# Altium project Water_Prj.PrjPCB
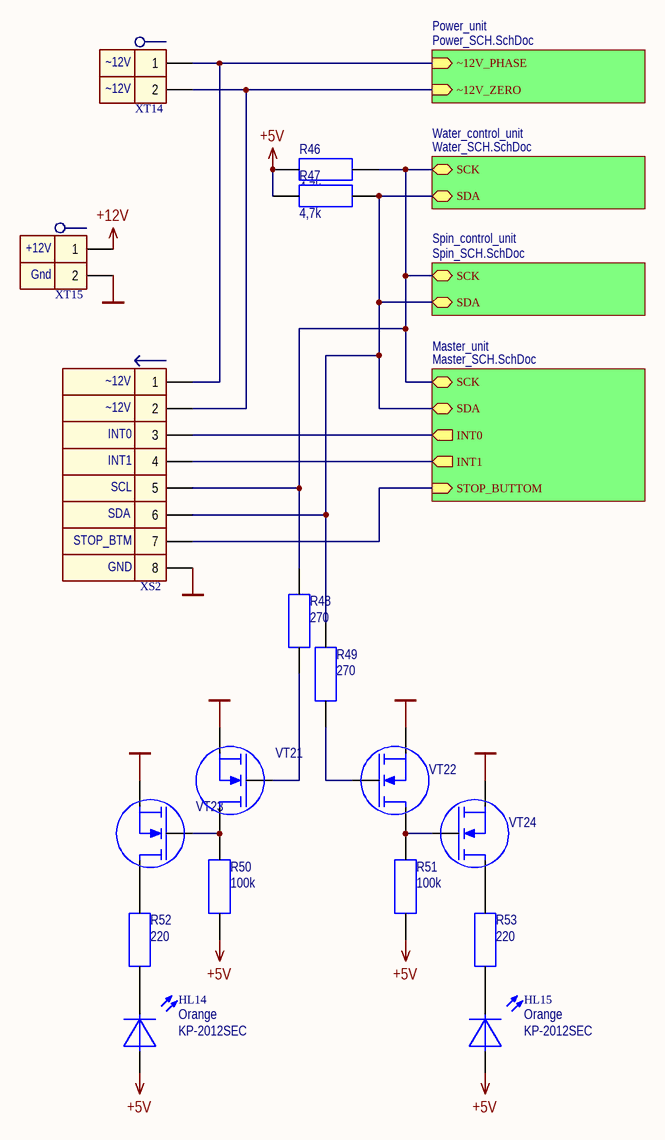
[diagram p0: TopSCH.SchDoc]
6 sheets, 230 parts. Net scope: hierarchical (ports join the sheet entries above them; power ports are global).
Board file: Control_PCB.PcbDoc
Sheets:
  TopSCH.SchDoc
    Water_control_unit = Water_SCH.SchDoc
      U_heatersControl = heatersControl.SchDoc
    Spin_control_unit = Spin_SCH.SchDoc
    Master_unit = Master_SCH.SchDoc
    Power_unit = Power_SCH.SchDoc

## Sheet TopSCH.SchDoc: Схема соединения
size 420 x 297 mm; ApprovedBy: Мешков; CheckedBy: Черноскутов; Author: Самойлов; CompanyName: РГППУ; Title2str: основных блоков; DecimalNumber: АБВГ.123456.001 33

### Parts
HL14  Orange  ManufacturerPartNumber: KP-2012SEC  [DIOMELF2012M]
HL15  Orange  ManufacturerPartNumber: KP-2012SEC  [DIOMELF2012M]
R46  4,7k  [SMDRC0805]
R47  4,7k  [SMDRC0805]
R48  270  [SMDRC0805]
R49  270  [SMDRC0805]
R50  100k  [SMDRC0805]
R51  100k  [SMDRC0805]
R52  220  [SMDRC0805]
R53  220  [SMDRC0805]
VT21  2N7002  [SOT23 (TO-236AB)]  (value not drawn)
VT22  2N7002  [SOT23 (TO-236AB)]  (value not drawn)
VT23  2N7002  [SOT23 (TO-236AB)]  (value not drawn)
VT24  2N7002  [SOT23 (TO-236AB)]  (value not drawn)
XS2  PLS-08R  [PLS-08R1]  (value not drawn)
XT14  330-021-12  [330-021-12]  (value not drawn)
XT15  330-021-12  [330-021-12]  (value not drawn)

### Sub-sheets
Master_unit = Master_SCH.SchDoc: SCK (bidir), SDA (bidir), STOP_BUTTOM (in), INT0 (out), INT1 (out)
Power_unit = Power_SCH.SchDoc: ~12V_PHASE (in), ~12V_ZERO (in)
Spin_control_unit = Spin_SCH.SchDoc: SCK (bidir), SDA (bidir)
Water_control_unit = Water_SCH.SchDoc: SCK (bidir), SDA (bidir)

### Nets
+5V: HL14.1 HL15.1 R46.2 R47.2 R50.2 R51.2
+12V: XT15.1
GND: VT21.2(S) VT22.2(S) VT23.2(S) VT24.2(S) XS2.8 XT15.2
~12V_PHASE: XS2.1 XT14.1 ; sheet Power_unit/~12V_PHASE
~12V_ZERO: XS2.2 XT14.2 ; sheet Power_unit/~12V_ZERO
NetDD1_19: R46.1 R48.2 XS2.5 ; sheet Water_control_unit/SCK, sheet Spin_control_unit/SCK, sheet Master_unit/SCK
NetDD1_20: R47.1 R49.2 XS2.6 ; sheet Water_control_unit/SDA, sheet Spin_control_unit/SDA, sheet Master_unit/SDA
NetDD3_12: XS2.7 ; sheet Master_unit/STOP_BUTTOM
NetDD3_13: XS2.3 ; sheet Master_unit/INT0
NetDD3_14: XS2.4 ; sheet Master_unit/INT1
NetHL14_2: HL14.2 R52.2
NetHL15_2: HL15.2 R53.2
NetR48_1: R48.1 VT21.1(G)
NetR49_1: R49.1 VT22.1(G)
NetR50_1: R50.1 VT21.3(D) VT23.1(G)
NetR51_1: R51.1 VT22.3(D) VT24.1(G)
NetR52_1: R52.1 VT23.3(D)
NetR53_1: R53.1 VT24.3(D)

### Notes on the sheet
- (near XT14) ~12V
- (near XT15) +12V
- (near XT15) Gnd
- (near XS2) ~12V
- (near XS2) INT0
- (near XS2) INT1
- (near XS2) SDA
- (near XS2) SCL
- (near XS2) STOP_BTM
- (near XS2) GND
- Изм.
- Лист
- N*докум.
- Подп.
- Дата
- Лит.
- Масса
- Масштаб
- Разраб.
- Пров.
- Т.контр.
- Лиcт
- Лиcтов
- Н.контр.
- Утв.

### Library data of the parts
HL14 HL15 = LED1_O: Diod LED SMD Orange; ComponentLink1Description: Datasheet; Cost: 4,91; ComponentLink2Description: Datasheet-local; ComponentLink2URL: *; Color: Orange
R46 R47 = Resistor 0805 4,7k: Generic resistor; PartNumber: Resistor 0805 4,7k; Value: 4,7k; ComponentLink1URL: http://www.mouser.com/ds/2/447/PYu-RC0402_51_RoHS_L_6_r-8721.pdf; ComponentLink1Description: Datasheet; Package: 0805
R48 R49 = Resistor 0805 270: Generic resistor; PartNumber: Resistor 0805 270; Value: 270; ComponentLink1URL: http://www.mouser.com/ds/2/447/PYu-RC0402_51_RoHS_L_6_r-8721.pdf; ComponentLink1Description: Datasheet; Package: 0805
R50 R51 = Resistor 0805 100k: Generic resistor; PartNumber: Resistor 0805 100k; Value: 100k; ComponentLink1URL: http://www.mouser.com/ds/2/447/PYu-RC0402_51_RoHS_L_6_r-8721.pdf; ComponentLink1Description: Datasheet; Package: 0805
R52 R53 = Resistor 0805 220: Generic resistor; PartNumber: Resistor 0805 220; Value: 220; ComponentLink1URL: http://www.mouser.com/ds/2/447/PYu-RC0402_51_RoHS_L_6_r-8721.pdf; ComponentLink1Description: Datasheet; Package: 0805
VT21-VT24 = 2N7002 n-MOSFET: 60V, 300mA N-channel Trench MOSFET; ManufacturerPartNumber: 2N7002
XS2 = Con8_M PLS-08MR: Male 8-pin connection; ManufacturerPartNumber: PLS-08R; ComponentLink1Description: Datasheet; ComponentLink1URL: http://www.promelec.ru/catalog/406/1218/1223/1/99528/; ComponentLink2Description: Datasheet-local; ComponentLink2URL: *
XT14 XT15 = Con2_D 330-021-12: Demountable connection  2-pin; Manufacturer: Degson Electronics Co., Ltd; ManufacturerPartNumber: 330-021-12; ComponentLink1Description: Datasheet; Cost: 7,45; Supplier: Промэлектроника; ComponentLink2Description: Datasheet-local

## Sheet Water_SCH.SchDoc: Блок управления
size 420 x 297 mm; ApprovedBy: Мешков; CheckedBy: Черноскутов; Author: Самойлов; CompanyName: РГППУ; Title2str: водой; DecimalNumber: АБВГ.123456.001 33
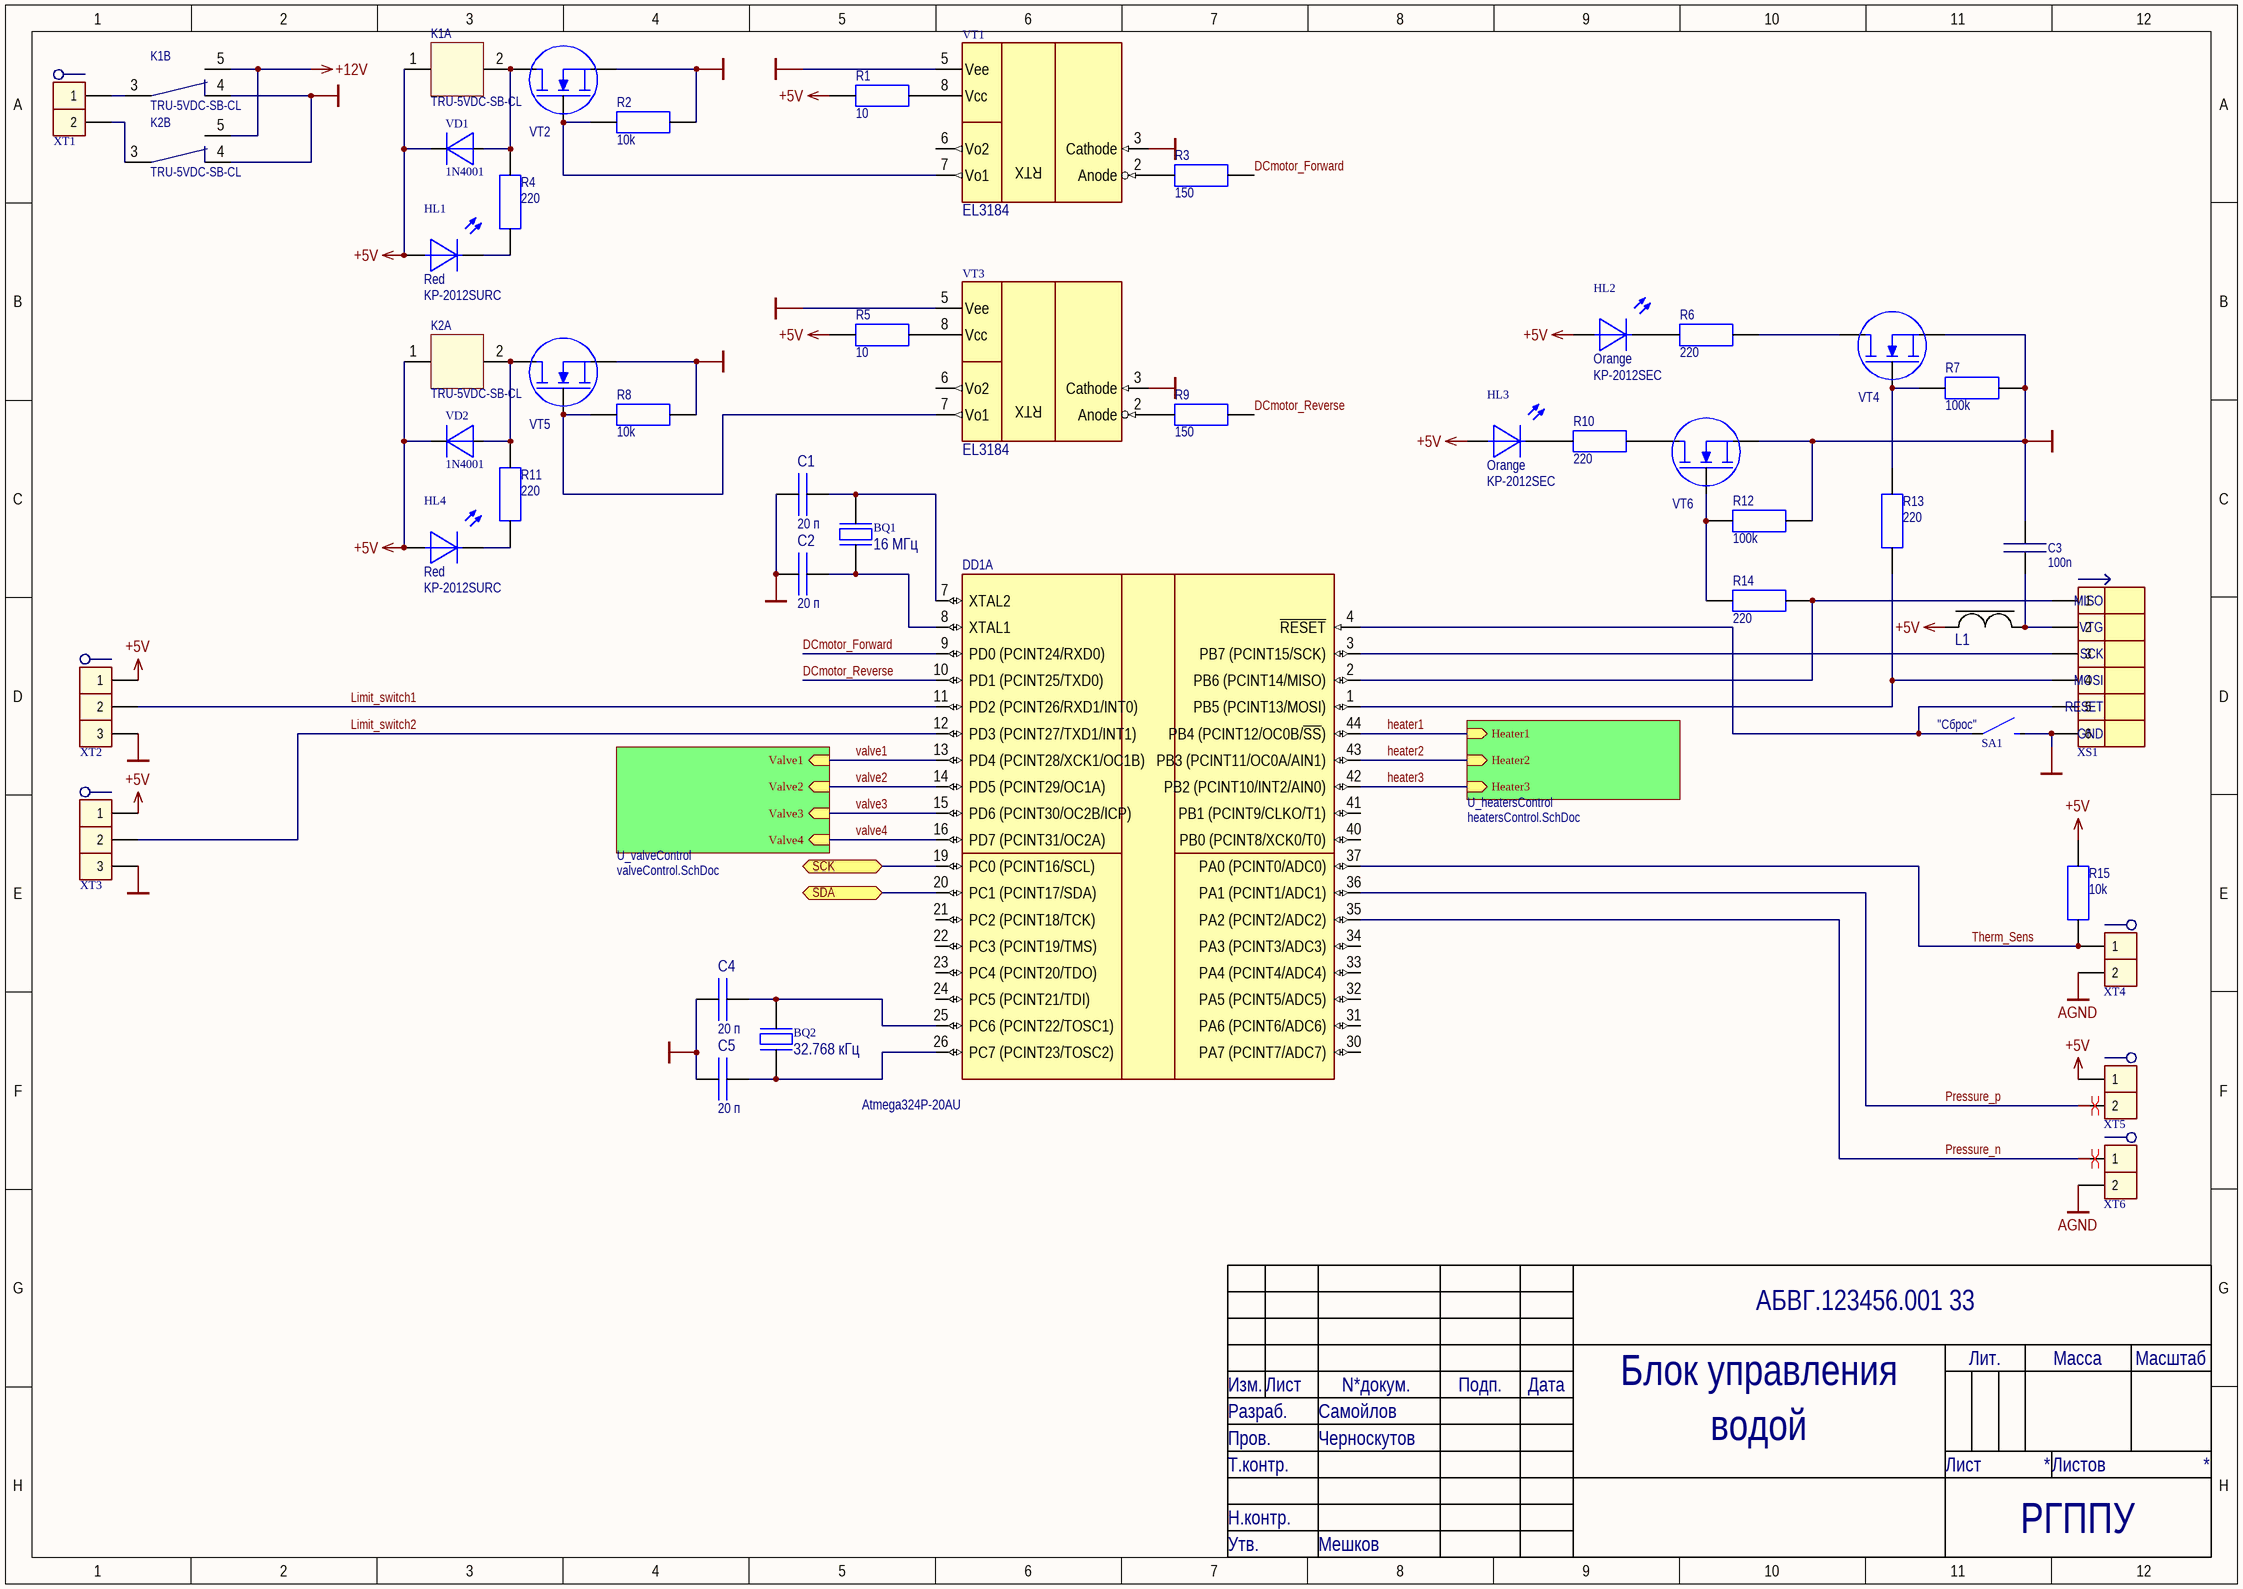
[diagram p1: Water_SCH.SchDoc]

### Parts
BQ1  16 МГц  [HC-49/S]
BQ2  32.768 кГц  [HC-49/S]
C1  value 20 п  [CAPC3216X05M]  (hidden comment: CC0603JRNP09BN200)
C2  value 20 п  [CAPC3216X05M]  (hidden comment: CC0603JRNP09BN200)
C3  100n  [SMDRC0805]
C4  value 20 п  [CAPC3216X05M]  (hidden comment: CC0603JRNP09BN200)
C5  value 20 п  [CAPC3216X05M]  (hidden comment: CC0603JRNP09BN200)
DD1  Atmega324P-20AU  [44ML_M]  (part A of 2)
HL1  Red  ManufacturerPartNumber: KP-2012SURC  [DIOMELF2012M]
HL2  Orange  ManufacturerPartNumber: KP-2012SEC  [DIOMELF2012M]
HL3  Orange  ManufacturerPartNumber: KP-2012SEC  [DIOMELF2012M]
HL4  Red  ManufacturerPartNumber: KP-2012SURC  [DIOMELF2012M]
K1  TRU-5VDC-SB-CL  [TRU-5VDC-SB-CL]  (parts A,B of 2)
K2  TRU-5VDC-SB-CL  [TRU-5VDC-SB-CL]  (parts A,B of 2)
L1  MPZ1608S181A  [INDC0603X03M]  (value not drawn)
R1  10  [SMDRC0805]
R2  10k  [SMDRC0805]
R3  150  [SMDRC0805]
R4  220  [SMDRC0805]
R5  10  [SMDRC0805]
R6  220  [SMDRC0805]
R7  100k  [SMDRC0805]
R8  10k  [SMDRC0805]
R9  150  [SMDRC0805]
R10  220  [SMDRC0805]
R11  220  [SMDRC0805]
R12  100k  [SMDRC0805]
R13  220  [SMDRC0805]
R14  220  [SMDRC0805]
R15  10k  [SMDRC0805]
SA1  DTSM20-4.3  [DTSM20]  (value not drawn)
VD1  1N4001  [PinDiode]
VD2  1N4001  [PinDiode]
VT1  EL3184  [DIP8]
VT2  2N7002  [SOT23 (TO-236AB)]  (value not drawn)
VT3  EL3184  [DIP8]
VT4  2N7002  [SOT23 (TO-236AB)]  (value not drawn)
VT5  2N7002  [SOT23 (TO-236AB)]  (value not drawn)
VT6  2N7002  [SOT23 (TO-236AB)]  (value not drawn)
XS1  IDC-06M  [IDC-06M]  (value not drawn)
XT1  330-021-12  [330-021-12]  (value not drawn)
XT2  330-031-12  [330-031-12]  (value not drawn)
XT3  330-031-12  [330-031-12]  (value not drawn)
XT4  330-021-12  [330-021-12]  (value not drawn)
XT5  330-021-12  [330-021-12]  (value not drawn)
XT6  330-021-12  [330-021-12]  (value not drawn)

### Sub-sheets
U_heatersControl = heatersControl.SchDoc: Heater1 (in), Heater2 (in), Heater3 (in)
U_valveСontrol = valveСontrol.SchDoc (file not in this document): Valve1 (in), Valve2 (in), Valve3 (in), Valve4 (in)

### Ports
SCK (bidir), SDA (bidir)

### Nets
+5V: HL1.1 HL2.1 HL3.1 HL4.1 K1.1 K2.1 L1.1 R1.2 R5.2 R15.2 VD1.K VD2.K XT2.1 XT3.1 XT5.1
+12V: K1.5 K2.5
AGND: XT4.2 XT6.2
GND: C1.2 C2.2 C3.2 C4.2 C5.2 K1.4 K2.4 R2.2 R7.2 R8.2 R12.2 SA1.2 VT1.3(Cathode) VT1.5(Vee) VT2.2(S) VT3.3(Cathode) VT3.5(Vee) VT4.2(S) VT5.2(S) VT6.2(S) XS1.6 XT2.3 XT3.3
DCmotor_Forward: DD1.9(PD0_(PCINT24/RXD0)) R3.1
DCmotor_Reverse: DD1.10(PD1_(PCINT25/TXD0)) R9.1
heater1: DD1.44(PB4_(PCINT12/OC0B/~{SS})) ; sheet U_heatersControl/Heater1
heater2: DD1.43(PB3_(PCINT11/OC0A/AIN1)) ; sheet U_heatersControl/Heater2
heater3: DD1.42(PB2_(PCINT10/INT2/AIN0)) ; sheet U_heatersControl/Heater3
Limit_switch1: DD1.11(PD2_(PCINT26/RXD1/INT0)) XT2.2
Limit_switch2: DD1.12(PD3_(PCINT27/TXD1/INT1)) XT3.2
Pressure_n: DD1.35(PA2_(PCINT2/ADC2)) XT6.1
Pressure_p: DD1.36(PA1_(PCINT1/ADC1)) XT5.2
Therm_Sens: DD1.37(PA0_(PCINT0/ADC0)) R15.1 XT4.1
valve1: DD1.13(PD4_(PCINT28/XCK1/OC1B)) ; sheet U_valveСontrol/Valve1
valve2: DD1.14(PD5_(PCINT29/OC1A)) ; sheet U_valveСontrol/Valve2
valve3: DD1.15(PD6_(PCINT30/OC2B/ICP)) ; sheet U_valveСontrol/Valve3
valve4: DD1.16(PD7_(PCINT31/OC2A)) ; sheet U_valveСontrol/Valve4
NetBQ1_1: BQ1.1 C2.1 DD1.8(XTAL1)
NetBQ1_2: BQ1.2 C1.1 DD1.7(XTAL2)
NetBQ2_1: BQ2.1 C5.1 DD1.26(PC7_(PCINT23/TOSC2))
NetBQ2_2: BQ2.2 C4.1 DD1.25(PC6_(PCINT22/TOSC1))
NetC3_1: C3.1 L1.2 XS1.2
NetDD1_1: DD1.1(PB5_(PCINT13/MOSI)) R13.1 XS1.4
NetDD1_2: DD1.2(PB6_(PCINT14/MISO)) R14.1 XS1.1
NetDD1_3: DD1.3(PB7_(PCINT15/SCK)) XS1.3
NetDD1_4: DD1.4(~{RESET}) SA1.1 XS1.5
NetDD1_19: DD1.19(PC0_(PCINT16/SCL)) ; port SCK
NetDD1_20: DD1.20(PC1_(PCINT17/SDA)) ; port SDA
NetHL1_2: HL1.2 R4.2
NetHL2_2: HL2.2 R6.2
NetHL3_2: HL3.2 R10.2
NetHL4_2: HL4.2 R11.2
NetK1_2: K1.2 R4.1 VD1.A VT2.3(D)
NetK1_3: K1.3 XT1.1
NetK2_2: K2.2 R11.1 VD2.A VT5.3(D)
NetK2_3: K2.3 XT1.2
NetR1_1: R1.1 VT1.8(Vcc)
NetR2_1: R2.1 VT1.7(Vo1) VT2.1(G)
NetR3_2: R3.2 VT1.2(Anode)
NetR5_1: R5.1 VT3.8(Vcc)
NetR6_1: R6.1 VT4.3(D)
NetR7_1: R7.1 R13.2 VT4.1(G)
NetR8_1: R8.1 VT3.7(Vo1) VT5.1(G)
NetR9_2: R9.2 VT3.2(Anode)
NetR10_1: R10.1 VT6.3(D)
NetR12_1: R12.1 R14.2 VT6.1(G)

Not connected (* = marked no-connect by the designer): DD1 21(PC2_(PCINT18/TCK)) 22(PC3_(PCINT19/TMS)) 23(PC4_(PCINT20/TDO)) 24(PC5_(PCINT21/TDI)) 30(PA7_(PCINT7/ADC7)) 31(PA6_(PCINT6/ADC6)) 32(PA5_(PCINT5/ADC5)) 33(PA4_(PCINT4/ADC4)) 34(PA3_(PCINT3/ADC3)) 40(PB0_(PCINT8/XCK0/T0)) 41(PB1_(PCINT9/CLKO/T1)); VT1 6(Vo2); VT3 6(Vo2)

### Layout directives
differential pair: Pressure_n, Pressure_p

### Notes on the sheet
- (near SA1) "Сброс"
- Изм.
- Лист
- N*докум.
- Подп.
- Дата
- Лит.
- Масса
- Масштаб
- Разраб.
- Пров.
- Т.контр.
- Лиcт
- Лиcтов
- Н.контр.
- Утв.
- (in symbol Con6_M IDC-06M_SPI) MISO; VTG; SCK; MOSI; RESET; GND
- (in symbol EL3184) RTX

### Library data of the parts
BQ1 BQ2 = Piezoelectric_16000: Piezoelectric elements; Manufacturer: Taizhou; ManufacturerPartNumber: 16000 кГц 20ppm 20pF; ComponentLink1URL: http://www.promelec.ru/catalog_info/54/126/246/70/; ComponentLink1Description: Datasheet; Package: HC-49/S; Cost: 8,54; Supplier: Промэлектроника; ComponentLink2Description: Datasheet-local
  BQ1: Value: 16 МГц
  BQ2: Value: 32.768 кГц
C1 C2 C4 C5 = p00020_050: 20pF Bipolar cap; Manufacturer: Yageo; ManufacturerPartNumber: CC0603JRNP09BN200; Supplier: Промэлектроника; Cost: 0,34; Package: 0603; ComponentLink1Description: Datasheet; ComponentLink1URL: http://www.yageo.com/documents/recent/UPY-GPHC_X5R_4V-to-50V_v16.pdf; ComponentLink2Description: Datasheet-local; ComponentLink2URL: *
C3 = Capacitor 0805 100n: Generic capasitor non-polar; PartNumber: Capacitor 0805 100n; Value: 100n; ComponentLink1Description: Datasheet; Package: 0805
DD1 = Atmega324P-20AU: Microcontroller 8-bit; Manufacturer: Atmel; ComponentLink1URL: http://www.atmel.com/Images/Atmel-8011-8-bit-AVR-Microcontroller-ATmega164P-324P-644P_datasheet.pdf; ComponentLink1Description: Datasheet; Cost: 220; Package: TQFP-44; Supplier: Промэлектроника; ManufacturerPartNumber: Atmega324P-20AU
HL1 HL4 = LED1_R: Diod LED SMD Red; ComponentLink1Description: Datasheet; Cost: 5,01; ComponentLink2Description: Datasheet-local; ComponentLink2URL: *; Color: Red
HL2 HL3 = LED1_O: Diod LED SMD Orange; ComponentLink1Description: Datasheet; Cost: 4,91; ComponentLink2Description: Datasheet-local; ComponentLink2URL: *; Color: Orange
L1 = Ferrite Bead: Value: ? мГн; ManufacturerPartNumber: MPZ1608S181A; ComponentLink1Description: Datasheet; Supplier: Промэлектроника; ComponentLink2Description: Datasheet-local; ComponentLink2URL: *
R1 R5 = Resistor 0805 10: Generic resistor; PartNumber: Resistor 0805 10; Value: 10; ComponentLink1URL: http://www.mouser.com/ds/2/447/PYu-RC0402_51_RoHS_L_6_r-8721.pdf; ComponentLink1Description: Datasheet; Package: 0805
R2 R8 R15 = Resistor 0805 10k: Generic resistor; PartNumber: Resistor 0805 10k; Value: 10k; ComponentLink1URL: http://www.mouser.com/ds/2/447/PYu-RC0402_51_RoHS_L_6_r-8721.pdf; ComponentLink1Description: Datasheet; Package: 0805
R3 R9 = Resistor 0805 150: Generic resistor; PartNumber: Resistor 0805 150; Value: 150; ComponentLink1URL: http://www.mouser.com/ds/2/447/PYu-RC0402_51_RoHS_L_6_r-8721.pdf; ComponentLink1Description: Datasheet; Package: 0805
R4 R6 R10 R11 R13 R14 = Resistor 0805 220: Generic resistor; PartNumber: Resistor 0805 220; Value: 220; ComponentLink1URL: http://www.mouser.com/ds/2/447/PYu-RC0402_51_RoHS_L_6_r-8721.pdf; ComponentLink1Description: Datasheet; Package: 0805
R7 R12 = Resistor 0805 100k: Generic resistor; PartNumber: Resistor 0805 100k; Value: 100k; ComponentLink1URL: http://www.mouser.com/ds/2/447/PYu-RC0402_51_RoHS_L_6_r-8721.pdf; ComponentLink1Description: Datasheet; Package: 0805
SA1 = Switch1_DTSM20-4.3: Switch open; Manufacturer: Diptronics; ManufacturerPartNumber: DTSM20-4.3; ComponentLink1Description: Datasheet; ComponentLink1URL: http://www.promelec.ru/catalog/407/1291/1323/1/70721/; ComponentLink2Description: Datasheet-local; ComponentLink2URL: *
VD1 VD2 = 1N4001: Rectifying diode; ComponentLink1Description: Datasheet; ComponentLink1URL: http://www.promelec.ru/pdf/1N400x.pdf; Cost: 5; Package: штырьевой; ComponentLink2Description: Datasheet-local; ComponentLink2URL: *; ManufacturerPartNumber: 1N4001
VT1 VT3 = EL3184: Optocouple IGBT driver; Manufacturer: Everlight Electronics Co. Ltd; Package: DIP-8; ComponentLink1URL: http://www.promelec.ru/pdf/EL3184-EVLT.pdf; ComponentLink1Description: Datasheet; Cost: 66,38; Supplier: Промэлектроника; ManufacturerPartNumber: EL3184
VT2 VT4-VT6 = 2N7002 n-MOSFET: 60V, 300mA N-channel Trench MOSFET; ManufacturerPartNumber: 2N7002
XS1 = Con6_M IDC-06M_SPI: SPI connector; ManufacturerPartNumber: IDC-06M; ComponentLink1Description: Datasheet; ComponentLink1URL: http://www.promelec.ru/catalog/406/1218/1223/1/156430/; ComponentLink2Description: Datasheet-local; ComponentLink2URL: *
XT1 XT4-XT6 = Con2_D 330-021-12: as XT14 on sheet TopSCH; ManufacturerPartNumber: 330-021-12; ComponentLink1Description: Datasheet; Cost: 7,45; Supplier: Промэлектроника; ComponentLink2Description: Datasheet-local
XT2 XT3 = Con3_D 330-031-12: Demountable connection 3-pin; Manufacturer: Degson Electronics Co., Ltd; ManufacturerPartNumber: 330-031-12; ComponentLink1Description: Datasheet; Cost: 13; Supplier: Промэлектроника; ComponentLink2Description: Datasheet-local
K1 K2 = TRU-5VDC-SB-CL: ManufacturerPurtNumber: TRU-5VDC-SB-CL

## Sheet heatersControl.SchDoc: Блок управления
size 420 x 297 mm; ApprovedBy: Мешков; CheckedBy: Черноскутов; Author: Самойлов; CompanyName: РГППУ; Title2str: нагревателями; DecimalNumber: АБВГ.123456.001 33
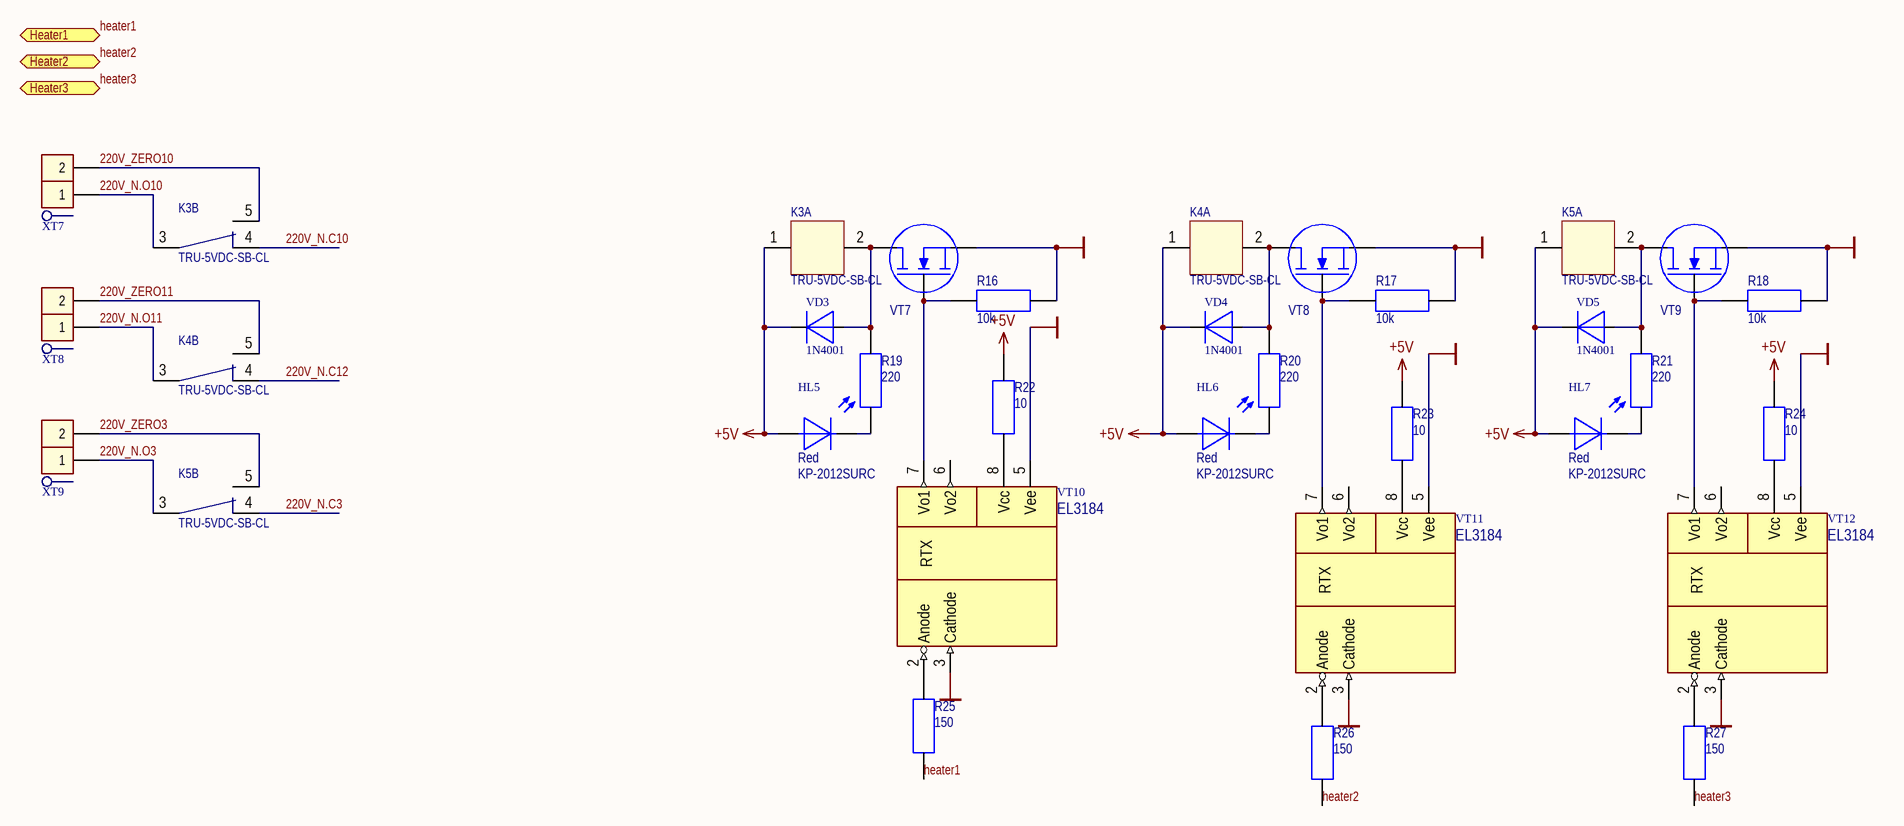
[diagram p2: heatersControl.SchDoc]

### Parts
HL5  Red  ManufacturerPartNumber: KP-2012SURC  [DIOMELF2012M]
HL6  Red  ManufacturerPartNumber: KP-2012SURC  [DIOMELF2012M]
HL7  Red  ManufacturerPartNumber: KP-2012SURC  [DIOMELF2012M]
K3  TRU-5VDC-SB-CL  [TRU-5VDC-SB-CL]  (parts A,B of 2)
K4  TRU-5VDC-SB-CL  [TRU-5VDC-SB-CL]  (parts A,B of 2)
K5  TRU-5VDC-SB-CL  [TRU-5VDC-SB-CL]  (parts A,B of 2)
R16  10k  [SMDRC0805]
R17  10k  [SMDRC0805]
R18  10k  [SMDRC0805]
R19  220  [SMDRC0805]
R20  220  [SMDRC0805]
R21  220  [SMDRC0805]
R22  10  [SMDRC0805]
R23  10  [SMDRC0805]
R24  10  [SMDRC0805]
R25  150  [SMDRC0805]
R26  150  [SMDRC0805]
R27  150  [SMDRC0805]
VD3  1N4001  [PinDiode]
VD4  1N4001  [PinDiode]
VD5  1N4001  [PinDiode]
VT7  2N7002  [SOT23 (TO-236AB)]  (value not drawn)
VT8  2N7002  [SOT23 (TO-236AB)]  (value not drawn)
VT9  2N7002  [SOT23 (TO-236AB)]  (value not drawn)
VT10  EL3184  [DIP8]
VT11  EL3184  [DIP8]
VT12  EL3184  [DIP8]
XT7  305-021-12  [330-021-12]  (value not drawn)
XT8  305-021-12  [330-021-12]  (value not drawn)
XT9  305-021-12  [330-021-12]  (value not drawn)

### Ports
Heater1 (in), Heater2 (in), Heater3 (in)

### Nets
+5V: HL5.1 HL6.1 HL7.1 K3.1 K4.1 K5.1 R22.2 R23.2 R24.2 VD3.K VD4.K VD5.K
GND: R16.2 R17.2 R18.2 VT7.2(S) VT8.2(S) VT9.2(S) VT10.3(Cathode) VT10.5(Vee) VT11.3(Cathode) VT11.5(Vee) VT12.3(Cathode) VT12.5(Vee)
220V_N.C3: K5.4
220V_N.C10: K3.4
220V_N.C12: K4.4
220V_N.O3: K5.3 XT9.1
220V_N.O10: K3.3 XT7.1
220V_N.O11: K4.3 XT8.1
220V_ZERO3: K5.5 XT9.2
220V_ZERO10: K3.5 XT7.2
220V_ZERO11: K4.5 XT8.2
heater1: R25.1 ; port Heater1
heater2: R26.1 ; port Heater2
heater3: R27.1 ; port Heater3
NetHL5_2: HL5.2 R19.2
NetHL6_2: HL6.2 R20.2
NetHL7_2: HL7.2 R21.2
NetK3_2: K3.2 R19.1 VD3.A VT7.3(D)
NetK4_2: K4.2 R20.1 VD4.A VT8.3(D)
NetK5_2: K5.2 R21.1 VD5.A VT9.3(D)
NetR16_1: R16.1 VT7.1(G) VT10.7(Vo1)
NetR17_1: R17.1 VT8.1(G) VT11.7(Vo1)
NetR18_1: R18.1 VT9.1(G) VT12.7(Vo1)
NetR22_1: R22.1 VT10.8(Vcc)
NetR23_1: R23.1 VT11.8(Vcc)
NetR24_1: R24.1 VT12.8(Vcc)
NetR25_2: R25.2 VT10.2(Anode)
NetR26_2: R26.2 VT11.2(Anode)
NetR27_2: R27.2 VT12.2(Anode)

Not connected (* = marked no-connect by the designer): VT10 6(Vo2); VT11 6(Vo2); VT12 6(Vo2)

### Notes on the sheet
- Изм.
- Лист
- N*докум.
- Подп.
- Дата
- Лит.
- Масса
- Масштаб
- Разраб.
- Пров.
- Т.контр.
- Лиcт
- Лиcтов
- Н.контр.
- Утв.
- (in symbol EL3184) RTX

### Library data of the parts
HL5-HL7 = LED1_R: Diod LED SMD Red; ComponentLink1Description: Datasheet; Cost: 5,01; ComponentLink2Description: Datasheet-local; ComponentLink2URL: *; Color: Red
R16-R18 = Resistor 0805 10k: Generic resistor; PartNumber: Resistor 0805 10k; Value: 10k; ComponentLink1URL: http://www.mouser.com/ds/2/447/PYu-RC0402_51_RoHS_L_6_r-8721.pdf; ComponentLink1Description: Datasheet; Package: 0805
R19-R21 = Resistor 0805 220: Generic resistor; PartNumber: Resistor 0805 220; Value: 220; ComponentLink1URL: http://www.mouser.com/ds/2/447/PYu-RC0402_51_RoHS_L_6_r-8721.pdf; ComponentLink1Description: Datasheet; Package: 0805
R22-R24 = Resistor 0805 10: Generic resistor; PartNumber: Resistor 0805 10; Value: 10; ComponentLink1URL: http://www.mouser.com/ds/2/447/PYu-RC0402_51_RoHS_L_6_r-8721.pdf; ComponentLink1Description: Datasheet; Package: 0805
R25-R27 = Resistor 0805 150: Generic resistor; PartNumber: Resistor 0805 150; Value: 150; ComponentLink1URL: http://www.mouser.com/ds/2/447/PYu-RC0402_51_RoHS_L_6_r-8721.pdf; ComponentLink1Description: Datasheet; Package: 0805
VD3-VD5 = 1N4001: Rectifying diode; ComponentLink1Description: Datasheet; ComponentLink1URL: http://www.promelec.ru/pdf/1N400x.pdf; Cost: 5; Package: штырьевой; ComponentLink2Description: Datasheet-local; ComponentLink2URL: *; ManufacturerPartNumber: 1N4001
VT7-VT9 = 2N7002 n-MOSFET: 60V, 300mA N-channel Trench MOSFET; ManufacturerPartNumber: 2N7002
VT10-VT12 = EL3184: as VT1 on sheet Water_SCH; Package: DIP-8; ComponentLink1URL: http://www.promelec.ru/pdf/EL3184-EVLT.pdf; ComponentLink1Description: Datasheet; Cost: 66,38; Supplier: Промэлектроника; ManufacturerPartNumber: EL3184
XT7-XT9 = Con2_D 305-021-12: Demountable connection  2-pin; Manufacturer: Degson Electronics Co., Ltd; ManufacturerPartNumber: 305-021-12; ComponentLink1Description: Datasheet; Cost: 7,45; Supplier: Промэлектроника; ComponentLink2Description: Datasheet-local
K3-K5 = TRU-5VDC-SB-CL: ManufacturerPurtNumber: TRU-5VDC-SB-CL

## Sheet Spin_SCH.SchDoc: Блок управления
size 420 x 297 mm; ApprovedBy: Мешков; CheckedBy: Черноскутов; Author: Самойлов; CompanyName: РГППУ; Title2str: моторами; DecimalNumber: АБВГ.123456.001 33
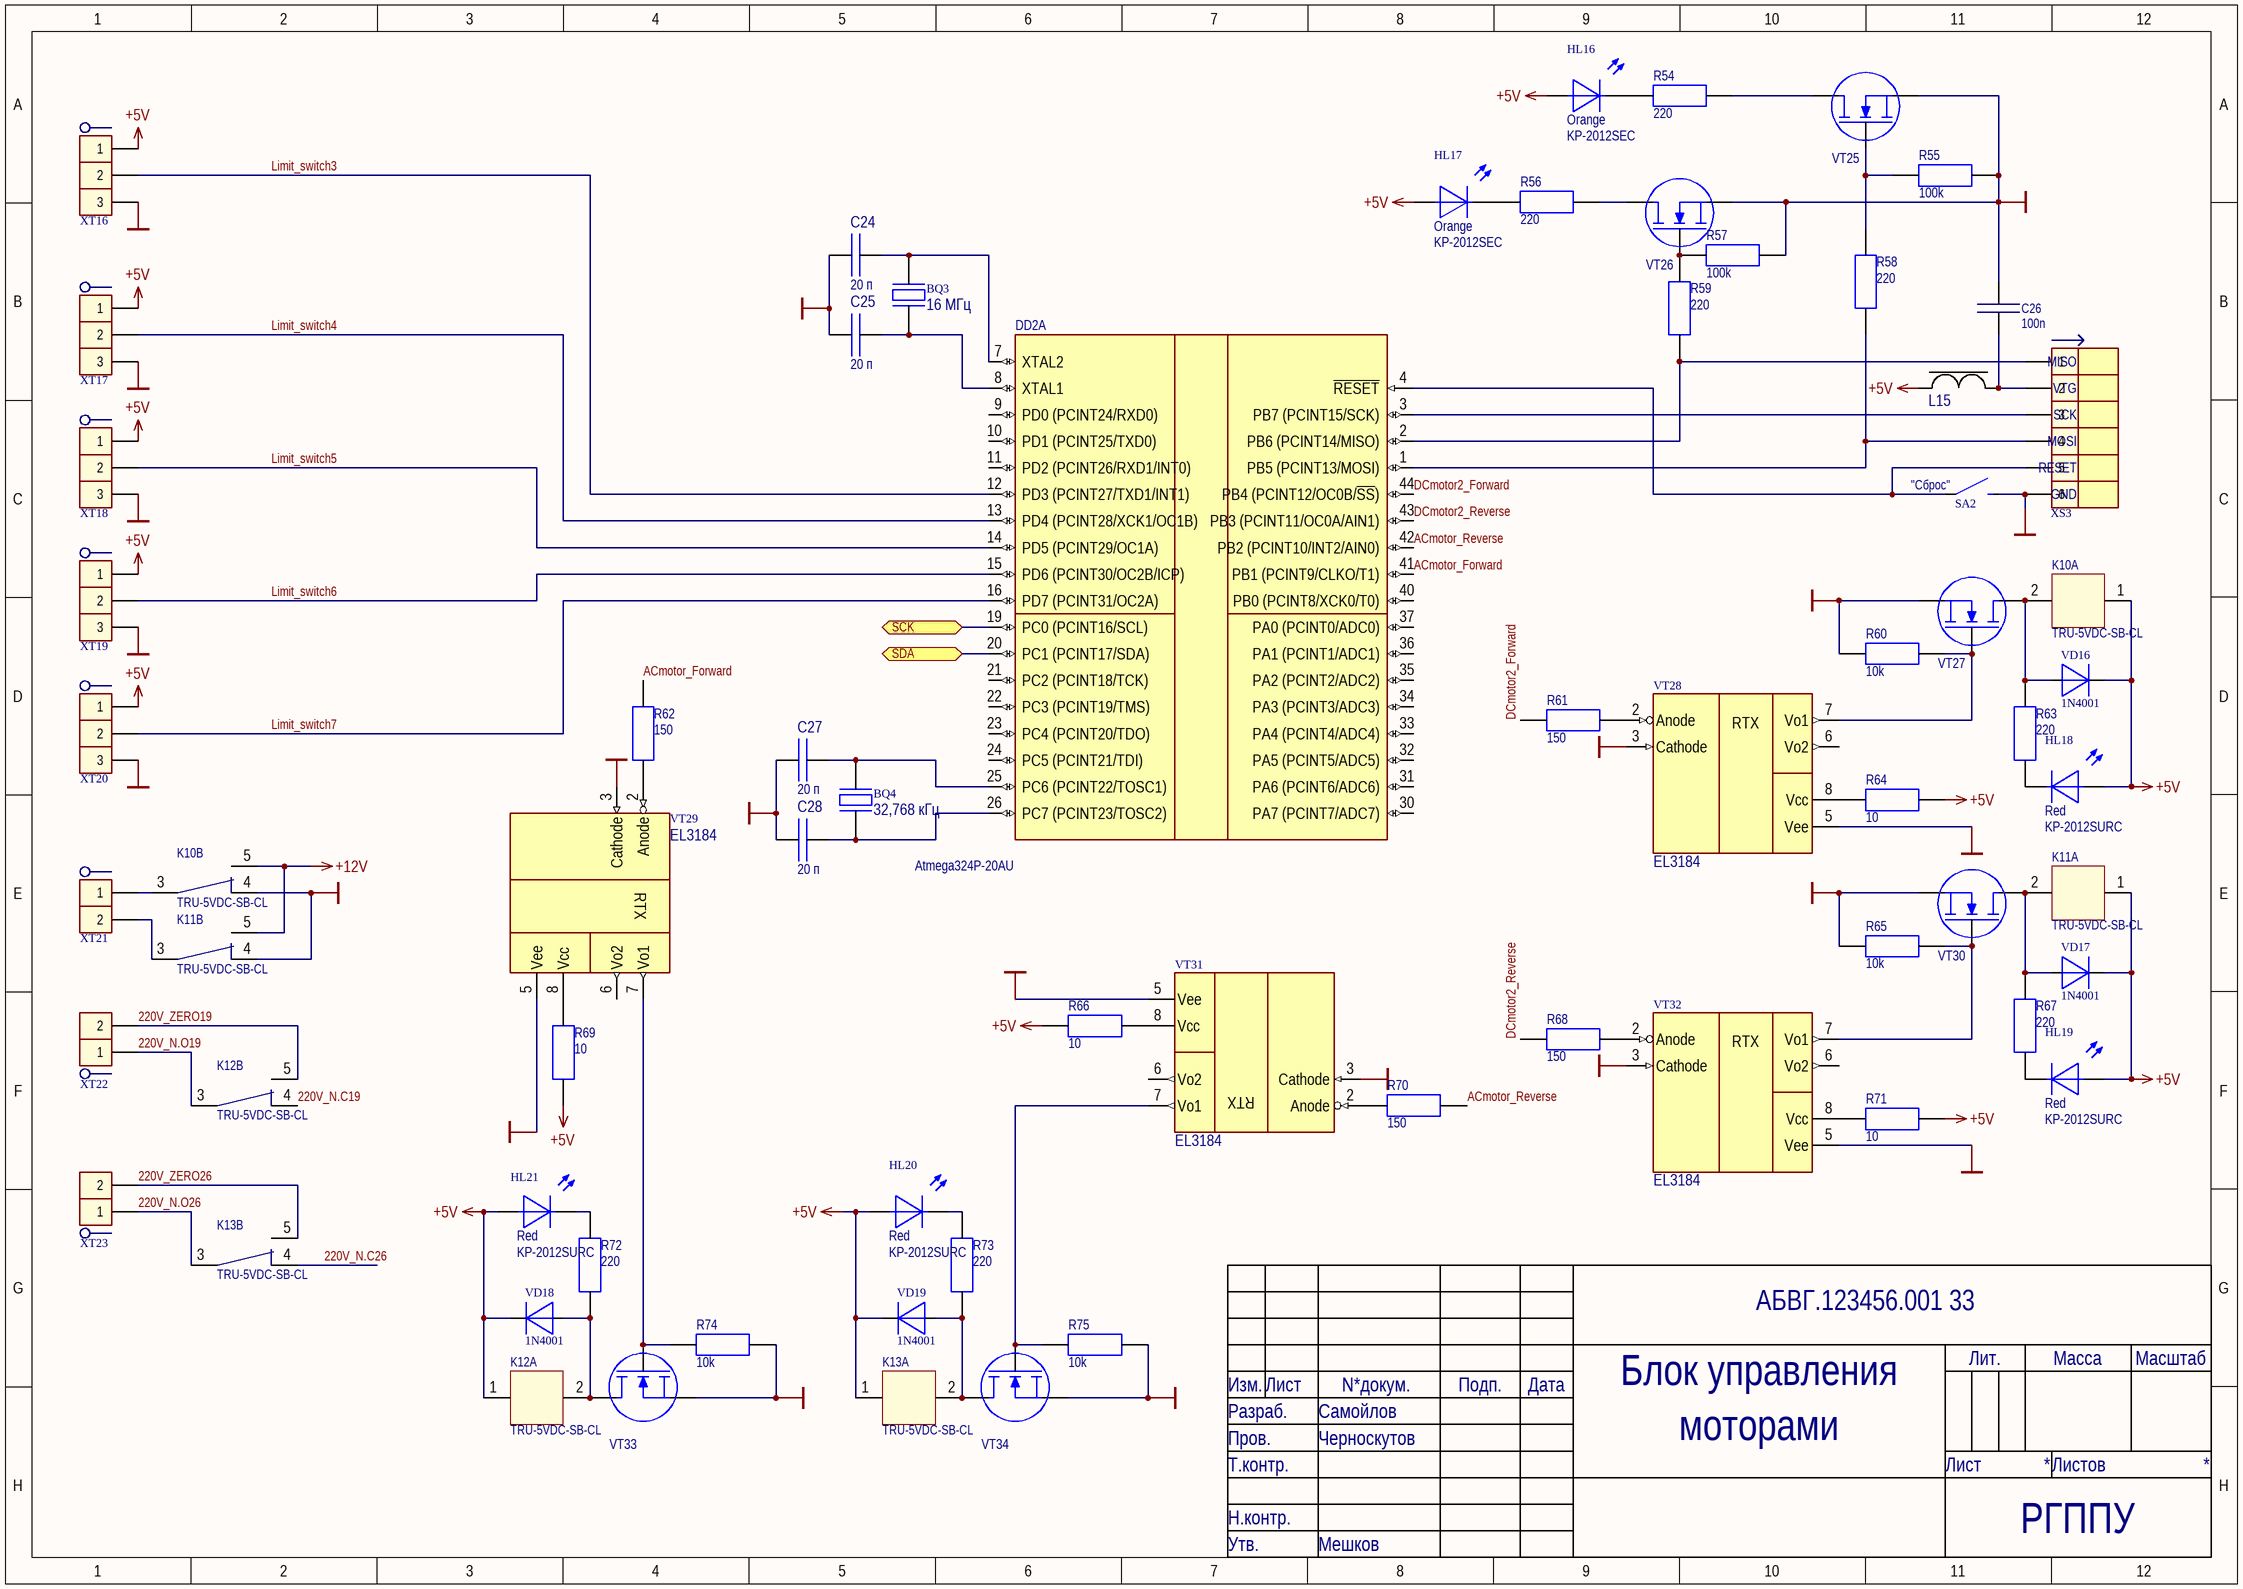
[diagram p3: Spin_SCH.SchDoc]

### Parts
BQ3  16 МГц  [HC-49/S]
BQ4  32,768 кГц  [HC-49/S]
C24  value 20 п  [CAPC3216X05M]  (hidden comment: CC0603JRNP09BN200)
C25  value 20 п  [CAPC3216X05M]  (hidden comment: CC0603JRNP09BN200)
C26  100n  [SMDRC0805]
C27  value 20 п  [CAPC3216X05M]  (hidden comment: CC0603JRNP09BN200)
C28  value 20 п  [CAPC3216X05M]  (hidden comment: CC0603JRNP09BN200)
DD2  Atmega324P-20AU  [44ML_M]  (part A of 2)
HL16  Orange  ManufacturerPartNumber: KP-2012SEC  [DIOMELF2012M]
HL17  Orange  ManufacturerPartNumber: KP-2012SEC  [DIOMELF2012M]
HL18  Red  ManufacturerPartNumber: KP-2012SURC  [DIOMELF2012M]
HL19  Red  ManufacturerPartNumber: KP-2012SURC  [DIOMELF2012M]
HL20  Red  ManufacturerPartNumber: KP-2012SURC  [DIOMELF2012M]
HL21  Red  ManufacturerPartNumber: KP-2012SURC  [DIOMELF2012M]
K10  TRU-5VDC-SB-CL  [TRU-5VDC-SB-CL]  (parts A,B of 2)
K11  TRU-5VDC-SB-CL  [TRU-5VDC-SB-CL]  (parts A,B of 2)
K12  TRU-5VDC-SB-CL  [TRU-5VDC-SB-CL]  (parts A,B of 2)
K13  TRU-5VDC-SB-CL  [TRU-5VDC-SB-CL]  (parts A,B of 2)
L15  MPZ1608S181A  [INDC0603X03M]  (value not drawn)
R54  220  [SMDRC0805]
R55  100k  [SMDRC0805]
R56  220  [SMDRC0805]
R57  100k  [SMDRC0805]
R58  220  [SMDRC0805]
R59  220  [SMDRC0805]
R60  10k  [SMDRC0805]
R61  150  [SMDRC0805]
R62  150  [SMDRC0805]
R63  220  [SMDRC0805]
R64  10  [SMDRC0805]
R65  10k  [SMDRC0805]
R66  10  [SMDRC0805]
R67  220  [SMDRC0805]
R68  150  [SMDRC0805]
R69  10  [SMDRC0805]
R70  150  [SMDRC0805]
R71  10  [SMDRC0805]
R72  220  [SMDRC0805]
R73  220  [SMDRC0805]
R74  10k  [SMDRC0805]
R75  10k  [SMDRC0805]
SA2  DTSM20-4.3  [DTSM20]  (value not drawn)
VD16  1N4001  [PinDiode]
VD17  1N4001  [PinDiode]
VD18  1N4001  [PinDiode]
VD19  1N4001  [PinDiode]
VT25  2N7002  [SOT23 (TO-236AB)]  (value not drawn)
VT26  2N7002  [SOT23 (TO-236AB)]  (value not drawn)
VT27  2N7002  [SOT23 (TO-236AB)]  (value not drawn)
VT28  EL3184  [DIP8]
VT29  EL3184  [DIP8]
VT30  2N7002  [SOT23 (TO-236AB)]  (value not drawn)
VT31  EL3184  [DIP8]
VT32  EL3184  [DIP8]
VT33  2N7002  [SOT23 (TO-236AB)]  (value not drawn)
VT34  2N7002  [SOT23 (TO-236AB)]  (value not drawn)
XS3  IDC-06M  [IDC-06M]  (value not drawn)
XT16  330-031-12  [330-031-12]  (value not drawn)
XT17  330-031-12  [330-031-12]  (value not drawn)
XT18  330-031-12  [330-031-12]  (value not drawn)
XT19  330-031-12  [330-031-12]  (value not drawn)
XT20  330-031-12  [330-031-12]  (value not drawn)
XT21  330-021-12  [330-021-12]  (value not drawn)
XT22  305-021-12  [330-021-12]  (value not drawn)
XT23  305-021-12  [330-021-12]  (value not drawn)

### Ports
SCK (bidir), SDA (bidir)

### Nets
+5V: HL16.1 HL17.1 HL18.1 HL19.1 HL20.1 HL21.1 K10.1 K11.1 K12.1 K13.1 L15.1 R64.2 R66.2 R69.2 R71.2 VD16.K VD17.K VD18.K VD19.K XT16.1 XT17.1 XT18.1 XT19.1 XT20.1
+12V: K10.5 K11.5
GND: C24.2 C25.2 C26.2 C27.2 C28.2 K10.4 K11.4 R55.2 R57.2 R60.2 R65.2 R74.2 R75.2 SA2.2 VT25.2(S) VT26.2(S) VT27.2(S) VT28.3(Cathode) VT28.5(Vee) VT29.3(Cathode) VT29.5(Vee) VT30.2(S) VT31.3(Cathode) VT31.5(Vee) VT32.3(Cathode) VT32.5(Vee) VT33.2(S) VT34.2(S) XS3.6 XT16.3 XT17.3 XT18.3 XT19.3 XT20.3
220V_N.C19: K12.4
220V_N.C26: K13.4
220V_N.O19: K12.3 XT22.1
220V_N.O26: K13.3 XT23.1
220V_ZERO19: K12.5 XT22.2
220V_ZERO26: K13.5 XT23.2
ACmotor_Forward: DD2.41(PB1_(PCINT9/CLKO/T1)) R62.1
ACmotor_Reverse: DD2.42(PB2_(PCINT10/INT2/AIN0)) R70.1
DCmotor2_Forward: DD2.44(PB4_(PCINT12/OC0B/~{SS})) R61.1
DCmotor2_Reverse: DD2.43(PB3_(PCINT11/OC0A/AIN1)) R68.1
Limit_switch3: DD2.12(PD3_(PCINT27/TXD1/INT1)) XT16.2
Limit_switch4: DD2.13(PD4_(PCINT28/XCK1/OC1B)) XT17.2
Limit_switch5: DD2.14(PD5_(PCINT29/OC1A)) XT18.2
Limit_switch6: DD2.15(PD6_(PCINT30/OC2B/ICP)) XT19.2
Limit_switch7: DD2.16(PD7_(PCINT31/OC2A)) XT20.2
NetBQ3_1: BQ3.1 C25.1 DD2.8(XTAL1)
NetBQ3_2: BQ3.2 C24.1 DD2.7(XTAL2)
NetBQ4_1: BQ4.1 C28.1 DD2.26(PC7_(PCINT23/TOSC2))
NetBQ4_2: BQ4.2 C27.1 DD2.25(PC6_(PCINT22/TOSC1))
NetC26_1: C26.1 L15.2 XS3.2
NetDD1_19: DD2.19(PC0_(PCINT16/SCL)) ; port SCK
NetDD1_20: DD2.20(PC1_(PCINT17/SDA)) ; port SDA
NetDD2_1: DD2.1(PB5_(PCINT13/MOSI)) R58.1 XS3.4
NetDD2_2: DD2.2(PB6_(PCINT14/MISO)) R59.1 XS3.1
NetDD2_3: DD2.3(PB7_(PCINT15/SCK)) XS3.3
NetDD2_4: DD2.4(~{RESET}) SA2.1 XS3.5
NetHL16_2: HL16.2 R54.2
NetHL17_2: HL17.2 R56.2
NetHL18_2: HL18.2 R63.2
NetHL19_2: HL19.2 R67.2
NetHL20_2: HL20.2 R73.2
NetHL21_2: HL21.2 R72.2
NetK10_2: K10.2 R63.1 VD16.A VT27.3(D)
NetK10_3: K10.3 XT21.1
NetK11_2: K11.2 R67.1 VD17.A VT30.3(D)
NetK11_3: K11.3 XT21.2
NetK12_2: K12.2 R72.1 VD18.A VT33.3(D)
NetK13_2: K13.2 R73.1 VD19.A VT34.3(D)
NetR54_1: R54.1 VT25.3(D)
NetR55_1: R55.1 R58.2 VT25.1(G)
NetR56_1: R56.1 VT26.3(D)
NetR57_1: R57.1 R59.2 VT26.1(G)
NetR60_1: R60.1 VT27.1(G) VT28.7(Vo1)
NetR61_2: R61.2 VT28.2(Anode)
NetR62_2: R62.2 VT29.2(Anode)
NetR64_1: R64.1 VT28.8(Vcc)
NetR65_1: R65.1 VT30.1(G) VT32.7(Vo1)
NetR66_1: R66.1 VT31.8(Vcc)
NetR68_2: R68.2 VT32.2(Anode)
NetR69_1: R69.1 VT29.8(Vcc)
NetR70_2: R70.2 VT31.2(Anode)
NetR71_1: R71.1 VT32.8(Vcc)
NetR74_1: R74.1 VT29.7(Vo1) VT33.1(G)
NetR75_1: R75.1 VT31.7(Vo1) VT34.1(G)

Not connected (* = marked no-connect by the designer): DD2 9(PD0_(PCINT24/RXD0)) 10(PD1_(PCINT25/TXD0)) 11(PD2_(PCINT26/RXD1/INT0)) 21(PC2_(PCINT18/TCK)) 22(PC3_(PCINT19/TMS)) 23(PC4_(PCINT20/TDO)) 24(PC5_(PCINT21/TDI)) 30(PA7_(PCINT7/ADC7)) 31(PA6_(PCINT6/ADC6)) 32(PA5_(PCINT5/ADC5)) 33(PA4_(PCINT4/ADC4)) 34(PA3_(PCINT3/ADC3)) 35(PA2_(PCINT2/ADC2)) 36(PA1_(PCINT1/ADC1)) 37(PA0_(PCINT0/ADC0)) 40(PB0_(PCINT8/XCK0/T0)); VT28 6(Vo2); VT29 6(Vo2); VT31 6(Vo2); VT32 6(Vo2)

### Notes on the sheet
- (near SA2) "Сброс"
- Изм.
- Лист
- N*докум.
- Подп.
- Дата
- Лит.
- Масса
- Масштаб
- Разраб.
- Пров.
- Т.контр.
- Лиcт
- Лиcтов
- Н.контр.
- Утв.
- (in symbol Con6_M IDC-06M_SPI) MISO; VTG; SCK; MOSI; RESET; GND
- (in symbol EL3184) RTX

### Library data of the parts
BQ3 BQ4 = Piezoelectric_16000: as BQ1 on sheet Water_SCH; ComponentLink1URL: http://www.promelec.ru/catalog_info/54/126/246/70/; ComponentLink1Description: Datasheet; Package: HC-49/S; Cost: 8,54; Supplier: Промэлектроника; ComponentLink2Description: Datasheet-local
  BQ3: Value: 16 МГц
  BQ4: Value: 32,768 кГц
C24 C25 C27 C28 = p00020_050: 20pF Bipolar cap; Manufacturer: Yageo; ManufacturerPartNumber: CC0603JRNP09BN200; Supplier: Промэлектроника; Cost: 0,34; Package: 0603; ComponentLink1Description: Datasheet; ComponentLink1URL: http://www.yageo.com/documents/recent/UPY-GPHC_X5R_4V-to-50V_v16.pdf; ComponentLink2Description: Datasheet-local; ComponentLink2URL: *
C26 = Capacitor 0805 100n: Generic capasitor non-polar; PartNumber: Capacitor 0805 100n; Value: 100n; ComponentLink1Description: Datasheet; Package: 0805
DD2 = Atmega324P-20AU: as DD1 on sheet Water_SCH; ComponentLink1URL: http://www.atmel.com/Images/Atmel-8011-8-bit-AVR-Microcontroller-ATmega164P-324P-644P_datasheet.pdf; ComponentLink1Description: Datasheet; Cost: 220; Package: TQFP-44; Supplier: Промэлектроника; ManufacturerPartNumber: Atmega324P-20AU
HL16 HL17 = LED1_O: Diod LED SMD Orange; ComponentLink1Description: Datasheet; Cost: 4,91; ComponentLink2Description: Datasheet-local; ComponentLink2URL: *; Color: Orange
HL18-HL21 = LED1_R: Diod LED SMD Red; ComponentLink1Description: Datasheet; Cost: 5,01; ComponentLink2Description: Datasheet-local; ComponentLink2URL: *; Color: Red
L15 = Ferrite Bead: Value: ? мГн; ManufacturerPartNumber: MPZ1608S181A; ComponentLink1Description: Datasheet; Supplier: Промэлектроника; ComponentLink2Description: Datasheet-local; ComponentLink2URL: *
R54 R56 R58 R59 R63 R67 R72 R73 = Resistor 0805 220: Generic resistor; PartNumber: Resistor 0805 220; Value: 220; ComponentLink1URL: http://www.mouser.com/ds/2/447/PYu-RC0402_51_RoHS_L_6_r-8721.pdf; ComponentLink1Description: Datasheet; Package: 0805
R55 R57 = Resistor 0805 100k: Generic resistor; PartNumber: Resistor 0805 100k; Value: 100k; ComponentLink1URL: http://www.mouser.com/ds/2/447/PYu-RC0402_51_RoHS_L_6_r-8721.pdf; ComponentLink1Description: Datasheet; Package: 0805
R60 R65 R74 R75 = Resistor 0805 10k: Generic resistor; PartNumber: Resistor 0805 10k; Value: 10k; ComponentLink1URL: http://www.mouser.com/ds/2/447/PYu-RC0402_51_RoHS_L_6_r-8721.pdf; ComponentLink1Description: Datasheet; Package: 0805
R61 R62 R68 R70 = Resistor 0805 150: Generic resistor; PartNumber: Resistor 0805 150; Value: 150; ComponentLink1URL: http://www.mouser.com/ds/2/447/PYu-RC0402_51_RoHS_L_6_r-8721.pdf; ComponentLink1Description: Datasheet; Package: 0805
R64 R66 R69 R71 = Resistor 0805 10: Generic resistor; PartNumber: Resistor 0805 10; Value: 10; ComponentLink1URL: http://www.mouser.com/ds/2/447/PYu-RC0402_51_RoHS_L_6_r-8721.pdf; ComponentLink1Description: Datasheet; Package: 0805
SA2 = Switch1_DTSM20-4.3: Switch open; Manufacturer: Diptronics; ManufacturerPartNumber: DTSM20-4.3; ComponentLink1Description: Datasheet; ComponentLink1URL: http://www.promelec.ru/catalog/407/1291/1323/1/70721/; ComponentLink2Description: Datasheet-local; ComponentLink2URL: *
VD16-VD19 = 1N4001: Rectifying diode; ComponentLink1Description: Datasheet; ComponentLink1URL: http://www.promelec.ru/pdf/1N400x.pdf; Cost: 5; Package: штырьевой; ComponentLink2Description: Datasheet-local; ComponentLink2URL: *; ManufacturerPartNumber: 1N4001
VT25-VT27 VT30 VT33 VT34 = 2N7002 n-MOSFET: 60V, 300mA N-channel Trench MOSFET; ManufacturerPartNumber: 2N7002
VT28 VT29 VT31 VT32 = EL3184: as VT1 on sheet Water_SCH; Package: DIP-8; ComponentLink1URL: http://www.promelec.ru/pdf/EL3184-EVLT.pdf; ComponentLink1Description: Datasheet; Cost: 66,38; Supplier: Промэлектроника; ManufacturerPartNumber: EL3184
XS3 = Con6_M IDC-06M_SPI: SPI connector; ManufacturerPartNumber: IDC-06M; ComponentLink1Description: Datasheet; ComponentLink1URL: http://www.promelec.ru/catalog/406/1218/1223/1/156430/; ComponentLink2Description: Datasheet-local; ComponentLink2URL: *
XT16-XT20 = Con3_D 330-031-12: as XT2 on sheet Water_SCH; ManufacturerPartNumber: 330-031-12; ComponentLink1Description: Datasheet; Cost: 13; Supplier: Промэлектроника; ComponentLink2Description: Datasheet-local
XT21 = Con2_D 330-021-12: as XT14 on sheet TopSCH; ManufacturerPartNumber: 330-021-12; ComponentLink1Description: Datasheet; Cost: 7,45; Supplier: Промэлектроника; ComponentLink2Description: Datasheet-local
XT22 XT23 = Con2_D 305-021-12: as XT7 on sheet heatersControl; ManufacturerPartNumber: 305-021-12; ComponentLink1Description: Datasheet; Cost: 7,45; Supplier: Промэлектроника; ComponentLink2Description: Datasheet-local
K10-K13 = TRU-5VDC-SB-CL: ManufacturerPurtNumber: TRU-5VDC-SB-CL

## Sheet Master_SCH.SchDoc: Блок контроля
size 420 x 297 mm; ApprovedBy: Мешков; CheckedBy: Черноскутов; Author: Самойлов; CompanyName: РГППУ; Title2str: токов; DecimalNumber: АБВГ.123456.001 33
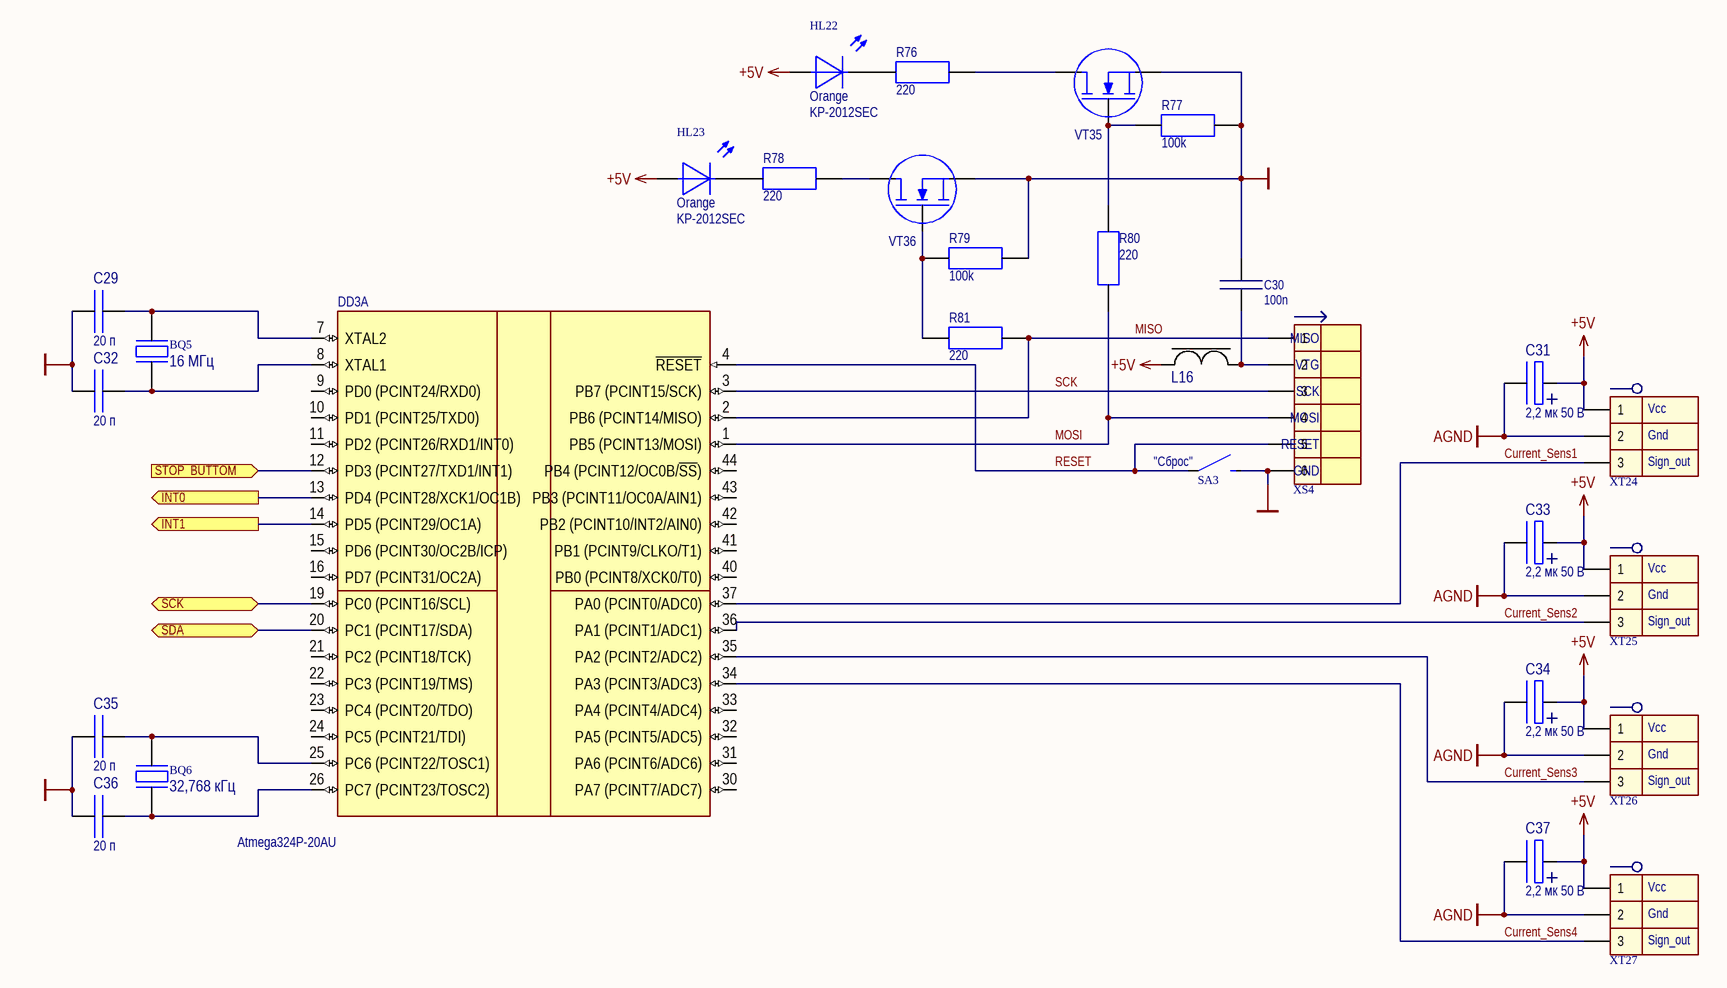
[diagram p4: Master_SCH.SchDoc]

### Parts
BQ5  16 МГц  [HC-49/S]
BQ6  32,768 кГц  [HC-49/S]
C29  value 20 п  [CAPC3216X05M]  (hidden comment: CC0603JRNP09BN200)
C30  100n  [SMDRC0805]
C31  value 2,2 мк 50 В  [CAP_POLAR_ELLYTE_B]  (hidden comment: CA050M2R20REB-0405)
C32  value 20 п  [CAPC3216X05M]  (hidden comment: CC0603JRNP09BN200)
C33  value 2,2 мк 50 В  [CAP_POLAR_ELLYTE_B]  (hidden comment: CA050M2R20REB-0405)
C34  value 2,2 мк 50 В  [CAP_POLAR_ELLYTE_B]  (hidden comment: CA050M2R20REB-0405)
C35  value 20 п  [CAPC3216X05M]  (hidden comment: CC0603JRNP09BN200)
C36  value 20 п  [CAPC3216X05M]  (hidden comment: CC0603JRNP09BN200)
C37  value 2,2 мк 50 В  [CAP_POLAR_ELLYTE_B]  (hidden comment: CA050M2R20REB-0405)
DD3  Atmega324P-20AU  [44ML_M]  (part A of 2)
HL22  Orange  ManufacturerPartNumber: KP-2012SEC  [DIOMELF2012M]
HL23  Orange  ManufacturerPartNumber: KP-2012SEC  [DIOMELF2012M]
L16  MPZ1608S181A  [INDC0603X03M]  (value not drawn)
R76  220  [SMDRC0805]
R77  100k  [SMDRC0805]
R78  220  [SMDRC0805]
R79  100k  [SMDRC0805]
R80  220  [SMDRC0805]
R81  220  [SMDRC0805]
SA3  DTSM20-4.3  [DTSM20]  (value not drawn)
VT35  2N7002  [SOT23 (TO-236AB)]  (value not drawn)
VT36  2N7002  [SOT23 (TO-236AB)]  (value not drawn)
XS4  IDC-06M  [IDC-06M]  (value not drawn)
XT24  330-031-12  [330-031-12]  (value not drawn)
XT25  330-031-12  [330-031-12]  (value not drawn)
XT26  330-031-12  [330-031-12]  (value not drawn)
XT27  330-031-12  [330-031-12]  (value not drawn)

### Ports
INT0 (out), INT1 (out), SCK (bidir), SDA (bidir), STOP_BUTTOM (in)

### Nets
+5V: C31.2(+) C33.2(+) C34.2(+) C37.2(+) HL22.1 HL23.1 L16.1 XT24.1 XT25.1 XT26.1 XT27.1
AGND: C31.1(-) C33.1(-) C34.1(-) C37.1(-) XT24.2 XT25.2 XT26.2 XT27.2
GND: C29.2 C30.2 C32.2 C35.2 C36.2 R77.2 R79.2 SA3.2 VT35.2(S) VT36.2(S) XS4.6
Current_Sens1: DD3.37(PA0_(PCINT0/ADC0)) XT24.3
Current_Sens2: DD3.36(PA1_(PCINT1/ADC1)) XT25.3
Current_Sens3: DD3.35(PA2_(PCINT2/ADC2)) XT26.3
Current_Sens4: DD3.34(PA3_(PCINT3/ADC3)) XT27.3
MISO: DD3.2(PB6_(PCINT14/MISO)) R81.1 XS4.1
MOSI: DD3.1(PB5_(PCINT13/MOSI)) R80.1 XS4.4
RESET: DD3.4(~{RESET}) SA3.1 XS4.5
SCK: DD3.3(PB7_(PCINT15/SCK)) XS4.3
NetBQ5_1: BQ5.1 C32.1 DD3.8(XTAL1)
NetBQ5_2: BQ5.2 C29.1 DD3.7(XTAL2)
NetBQ6_1: BQ6.1 C36.1 DD3.26(PC7_(PCINT23/TOSC2))
NetBQ6_2: BQ6.2 C35.1 DD3.25(PC6_(PCINT22/TOSC1))
NetC30_1: C30.1 L16.2 XS4.2
NetDD1_19: DD3.19(PC0_(PCINT16/SCL)) ; port SCK
NetDD1_20: DD3.20(PC1_(PCINT17/SDA)) ; port SDA
NetDD3_12: DD3.12(PD3_(PCINT27/TXD1/INT1)) ; port STOP_BUTTOM
NetDD3_13: DD3.13(PD4_(PCINT28/XCK1/OC1B)) ; port INT0
NetDD3_14: DD3.14(PD5_(PCINT29/OC1A)) ; port INT1
NetHL22_2: HL22.2 R76.2
NetHL23_2: HL23.2 R78.2
NetR76_1: R76.1 VT35.3(D)
NetR77_1: R77.1 R80.2 VT35.1(G)
NetR78_1: R78.1 VT36.3(D)
NetR79_1: R79.1 R81.2 VT36.1(G)

Not connected (* = marked no-connect by the designer): DD3 9(PD0_(PCINT24/RXD0)) 10(PD1_(PCINT25/TXD0)) 11(PD2_(PCINT26/RXD1/INT0)) 15(PD6_(PCINT30/OC2B/ICP)) 16(PD7_(PCINT31/OC2A)) 21(PC2_(PCINT18/TCK)) 22(PC3_(PCINT19/TMS)) 23(PC4_(PCINT20/TDO)) 24(PC5_(PCINT21/TDI)) 30(PA7_(PCINT7/ADC7)) 31(PA6_(PCINT6/ADC6)) 32(PA5_(PCINT5/ADC5)) 33(PA4_(PCINT4/ADC4)) 40(PB0_(PCINT8/XCK0/T0)) 41(PB1_(PCINT9/CLKO/T1)) 42(PB2_(PCINT10/INT2/AIN0)) 43(PB3_(PCINT11/OC0A/AIN1)) 44(PB4_(PCINT12/OC0B/~{SS}))

### Notes on the sheet
- (near SA3) "Сброс"
- (near XT24) Vcc
- (near XT24) Gnd
- (near XT24) Sign_out
- (near XT25) Vcc
- (near XT25) Gnd
- (near XT25) Sign_out
- (near XT26) Vcc
- (near XT26) Gnd
- (near XT26) Sign_out
- (near XT27) Vcc
- (near XT27) Gnd
- (near XT27) Sign_out
- Изм.
- Лист
- N*докум.
- Подп.
- Дата
- Лит.
- Масса
- Масштаб
- Разраб.
- Пров.
- Т.контр.
- Лиcт
- Лиcтов
- Н.контр.
- Утв.
- (in symbol Con6_M IDC-06M_SPI) MISO; VTG; SCK; MOSI; RESET; GND

### Library data of the parts
BQ5 BQ6 = Piezoelectric_16000: as BQ1 on sheet Water_SCH; ComponentLink1URL: http://www.promelec.ru/catalog_info/54/126/246/70/; ComponentLink1Description: Datasheet; Package: HC-49/S; Cost: 8,54; Supplier: Промэлектроника; ComponentLink2Description: Datasheet-local
  BQ5: Value: 16 МГц
  BQ6: Value: 32,768 кГц
C29 C32 C35 C36 = p00020_050: 20pF Bipolar cap; Manufacturer: Yageo; ManufacturerPartNumber: CC0603JRNP09BN200; Supplier: Промэлектроника; Cost: 0,34; Package: 0603; ComponentLink1Description: Datasheet; ComponentLink1URL: http://www.yageo.com/documents/recent/UPY-GPHC_X5R_4V-to-50V_v16.pdf; ComponentLink2Description: Datasheet-local; ComponentLink2URL: *
C30 = Capacitor 0805 100n: Generic capasitor non-polar; PartNumber: Capacitor 0805 100n; Value: 100n; ComponentLink1Description: Datasheet; Package: 0805
C31 C33 C34 C37 = 02200_050: 2,2uF 50V Polar capacitor; Manufacturer: Yageo; ManufacturerPartNumber: CA050M2R20REB-0405; Supplier: Промэлектроника; Cost: 4,11; Package: not standard; ComponentLink1Description: Datasheet; ComponentLink1URL: http://www.yageo.com/documents/recent/E-Cap_SurfaceMount_CA_2011.pdf; ComponentLink2Description: Datasheet-local; ComponentLink2URL: *
DD3 = Atmega324P-20AU: as DD1 on sheet Water_SCH; ComponentLink1URL: http://www.atmel.com/Images/Atmel-8011-8-bit-AVR-Microcontroller-ATmega164P-324P-644P_datasheet.pdf; ComponentLink1Description: Datasheet; Cost: 220; Package: TQFP-44; Supplier: Промэлектроника; ManufacturerPartNumber: Atmega324P-20AU
HL22 HL23 = LED1_O: Diod LED SMD Orange; ComponentLink1Description: Datasheet; Cost: 4,91; ComponentLink2Description: Datasheet-local; ComponentLink2URL: *; Color: Orange
L16 = Ferrite Bead: Value: ? мГн; ManufacturerPartNumber: MPZ1608S181A; ComponentLink1Description: Datasheet; Supplier: Промэлектроника; ComponentLink2Description: Datasheet-local; ComponentLink2URL: *
R76 R78 R80 R81 = Resistor 0805 220: Generic resistor; PartNumber: Resistor 0805 220; Value: 220; ComponentLink1URL: http://www.mouser.com/ds/2/447/PYu-RC0402_51_RoHS_L_6_r-8721.pdf; ComponentLink1Description: Datasheet; Package: 0805
R77 R79 = Resistor 0805 100k: Generic resistor; PartNumber: Resistor 0805 100k; Value: 100k; ComponentLink1URL: http://www.mouser.com/ds/2/447/PYu-RC0402_51_RoHS_L_6_r-8721.pdf; ComponentLink1Description: Datasheet; Package: 0805
SA3 = Switch1_DTSM20-4.3: Switch open; Manufacturer: Diptronics; ManufacturerPartNumber: DTSM20-4.3; ComponentLink1Description: Datasheet; ComponentLink1URL: http://www.promelec.ru/catalog/407/1291/1323/1/70721/; ComponentLink2Description: Datasheet-local; ComponentLink2URL: *
VT35 VT36 = 2N7002 n-MOSFET: 60V, 300mA N-channel Trench MOSFET; ManufacturerPartNumber: 2N7002
XS4 = Con6_M IDC-06M_SPI: SPI connector; ManufacturerPartNumber: IDC-06M; ComponentLink1Description: Datasheet; ComponentLink1URL: http://www.promelec.ru/catalog/406/1218/1223/1/156430/; ComponentLink2Description: Datasheet-local; ComponentLink2URL: *
XT24-XT27 = Con3_D 330-031-12: as XT2 on sheet Water_SCH; ManufacturerPartNumber: 330-031-12; ComponentLink1Description: Datasheet; Cost: 13; Supplier: Промэлектроника; ComponentLink2Description: Datasheet-local

## Sheet Power_SCH.SchDoc: Схема
size 420 x 297 mm; ApprovedBy: Мешков; CheckedBy: Черноскутов; Author: Самойлов; CompanyName: РГППУ; Title2str: питания; DecimalNumber: АБВГ.123456.001 33
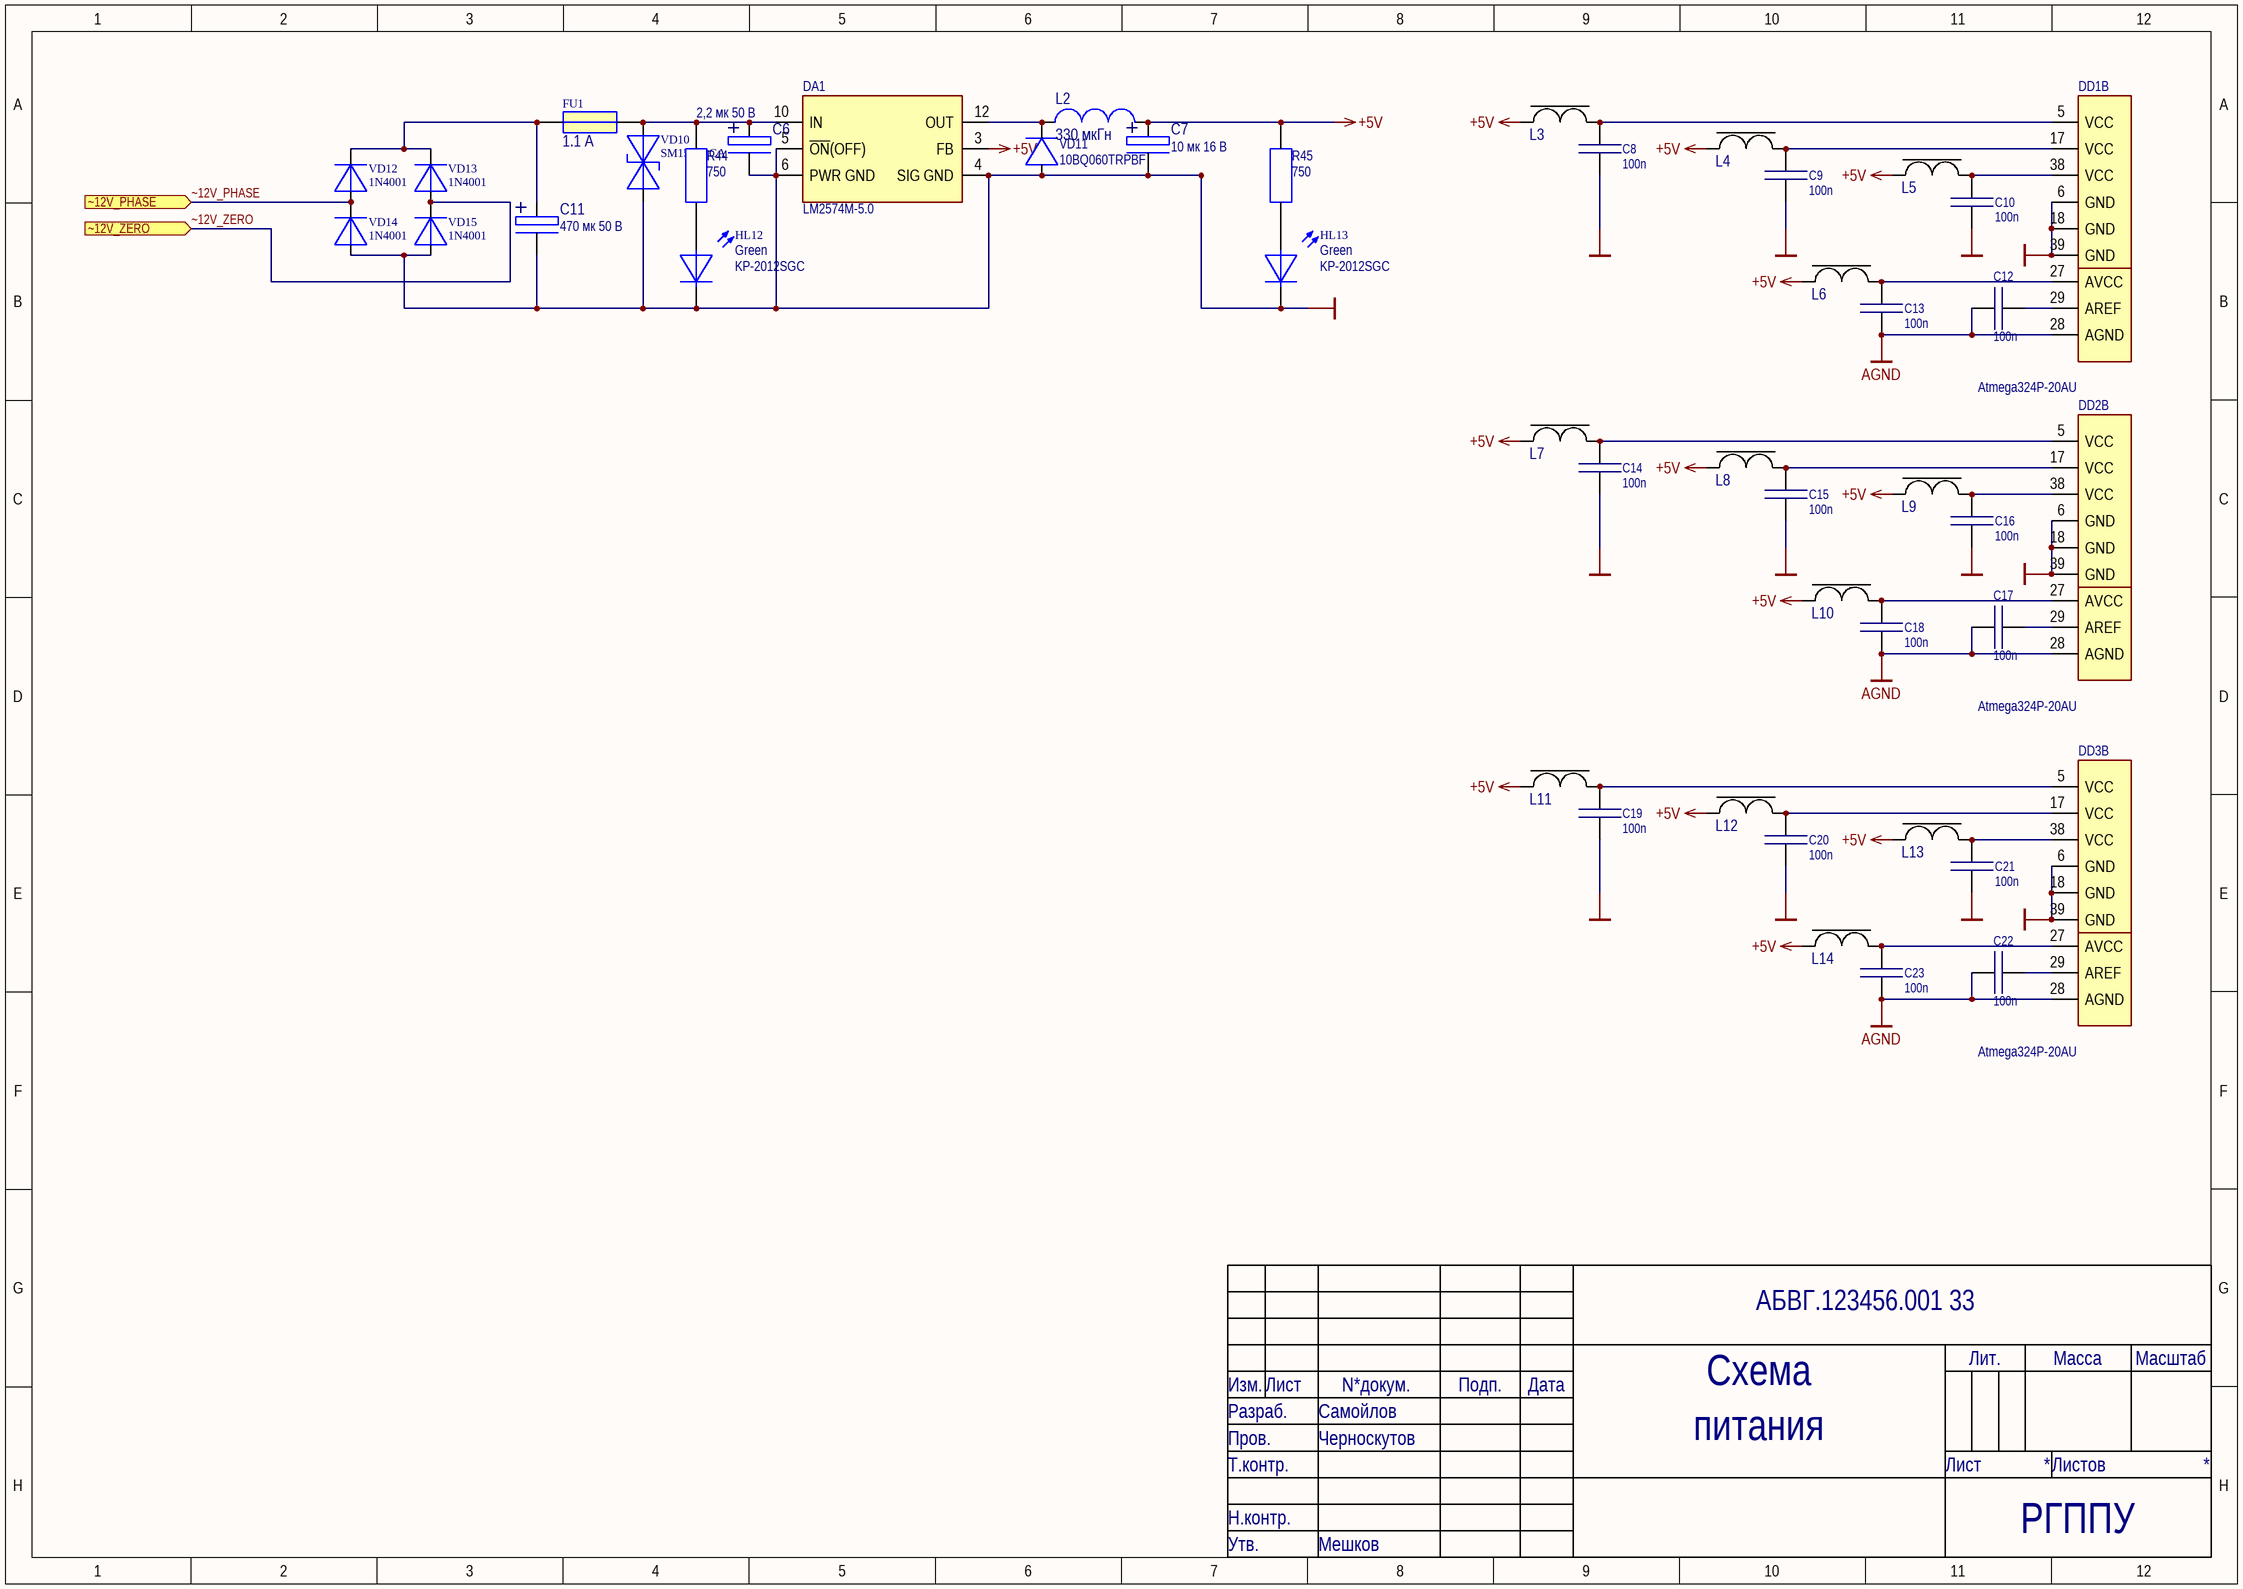
[diagram p5: Power_SCH.SchDoc]

### Parts
C6  value 2,2 мк 50 В  [CAP_POLAR_ELLYTE_B]  (hidden comment: CA050M2R20REB-0405)
C7  value 10 мк 16 В  [CAP_POLAR_ELLYTE_B]  (hidden comment: CA016M0010REB-0405)
C8  100n  [SMDRC0805]
C9  100n  [SMDRC0805]
C10  100n  [SMDRC0805]
C11  value 470 мк 50 В  [CAP_POLAR_10mm]  (hidden comment: CA035M0220REG)
C12  100n  [SMDRC0805]
C13  100n  [SMDRC0805]
C14  100n  [SMDRC0805]
C15  100n  [SMDRC0805]
C16  100n  [SMDRC0805]
C17  100n  [SMDRC0805]
C18  100n  [SMDRC0805]
C19  100n  [SMDRC0805]
C20  100n  [SMDRC0805]
C21  100n  [SMDRC0805]
C22  100n  [SMDRC0805]
C23  100n  [SMDRC0805]
DA1  LM2574M-5.0  [SOIC127P1030X264-14M]
DD1  Atmega324P-20AU  [44ML_M]  (part B of 2)
DD2  Atmega324P-20AU  [44ML_M]  (part B of 2)
DD3  Atmega324P-20AU  [44ML_M]  (part B of 2)
FU1  value 1.1 А  [EFuse 1.1A]  (hidden comment: EFuse LP60-110F)
HL12  Green  ManufacturerPartNumber: KP-2012SGC  [DIOMELF2012M]
HL13  Green  ManufacturerPartNumber: KP-2012SGC  [DIOMELF2012M]
L2  value 330 мкГн  [INDP7972X50M]  (hidden comment: SCD0705T-331K-N)
L3  MPZ1608S181A  [INDC0603X03M]  (value not drawn)
L4  MPZ1608S181A  [INDC0603X03M]  (value not drawn)
L5  MPZ1608S181A  [INDC0603X03M]  (value not drawn)
L6  MPZ1608S181A  [INDC0603X03M]  (value not drawn)
L7  MPZ1608S181A  [INDC0603X03M]  (value not drawn)
L8  MPZ1608S181A  [INDC0603X03M]  (value not drawn)
L9  MPZ1608S181A  [INDC0603X03M]  (value not drawn)
L10  MPZ1608S181A  [INDC0603X03M]  (value not drawn)
L11  MPZ1608S181A  [INDC0603X03M]  (value not drawn)
L12  MPZ1608S181A  [INDC0603X03M]  (value not drawn)
L13  MPZ1608S181A  [INDC0603X03M]  (value not drawn)
L14  MPZ1608S181A  [INDC0603X03M]  (value not drawn)
R44  750  [SMDRC0805]
R45  750  [SMDRC0805]
VD10  SM15T12CA  [SUPRES3216X18N]
VD11  10BQ060TRPBF  [SHOTKY 4.1x3.3]
VD12  1N4001  [PinDiode]
VD13  1N4001  [PinDiode]
VD14  1N4001  [PinDiode]
VD15  1N4001  [PinDiode]

### Ports
~12V_PHASE (in), ~12V_ZERO (in)

### Nets
+5V: C7.2(+) DA1.3(FB) L2.1 L3.1 L4.1 L5.1 L6.1 L7.1 L8.1 L9.1 L10.1 L11.1 L12.1 L13.1 L14.1 R45.2
AGND: C12.1 C13.1 C17.1 C18.1 C22.1 C23.1 DD1.28(AGND) DD2.28(AGND) DD3.28(AGND)
GND: C6.1(-) C7.1(-) C8.1 C9.1 C10.1 C11.1(-) C14.1 C15.1 C16.1 C19.1 C20.1 C21.1 DA1.4(SIG_GND) DA1.5(~{ON}(OFF)) DA1.6(PWR_GND) DD1.6(GND) DD1.18(GND) DD1.39(GND) DD2.6(GND) DD2.18(GND) DD2.39(GND) DD3.6(GND) DD3.18(GND) DD3.39(GND) HL12.2 HL13.2 VD10.1 VD11.A VD14.A VD15.A
~12V_PHASE: VD12.A VD14.K ; port ~12V_PHASE
~12V_ZERO: VD13.A VD15.K ; port ~12V_ZERO
NetC6_2: C6.2(+) DA1.10(IN) FU1.2 R44.2 VD10.2
NetC8_2: C8.2 DD1.5(VCC) L3.2
NetC9_2: C9.2 DD1.17(VCC) L4.2
NetC10_2: C10.2 DD1.38(VCC) L5.2
NetC11_2: C11.2(+) FU1.1 VD12.K VD13.K
NetC12_2: C12.2 DD1.29(AREF)
NetC13_2: C13.2 DD1.27(AVCC) L6.2
NetC14_2: C14.2 DD2.5(VCC) L7.2
NetC15_2: C15.2 DD2.17(VCC) L8.2
NetC16_2: C16.2 DD2.38(VCC) L9.2
NetC17_2: C17.2 DD2.29(AREF)
NetC18_2: C18.2 DD2.27(AVCC) L10.2
NetC19_2: C19.2 DD3.5(VCC) L11.2
NetC20_2: C20.2 DD3.17(VCC) L12.2
NetC21_2: C21.2 DD3.38(VCC) L13.2
NetC22_2: C22.2 DD3.29(AREF)
NetC23_2: C23.2 DD3.27(AVCC) L14.2
NetDA1_12: DA1.12(OUT) L2.2 VD11.K
NetHL12_1: HL12.1 R44.1
NetHL13_1: HL13.1 R45.1

### Notes on the sheet
- Изм.
- Лист
- N*докум.
- Подп.
- Дата
- Лит.
- Масса
- Масштаб
- Разраб.
- Пров.
- Т.контр.
- Лиcт
- Лиcтов
- Н.контр.
- Утв.

### Library data of the parts
C6 = 02200_050: as C31 on sheet Master_SCH; ManufacturerPartNumber: CA050M2R20REB-0405; Supplier: Промэлектроника; Cost: 4,11; Package: not standard; ComponentLink1Description: Datasheet; ComponentLink1URL: http://www.yageo.com/documents/recent/E-Cap_SurfaceMount_CA_2011.pdf; ComponentLink2Description: Datasheet-local; ComponentLink2URL: *
C7 = 10000_016: 10uF 16V Polar SMD cap; Manufacturer: YAGEO; ManufacturerPartNumber: CA016M0010REB-0405; Supplier: -; Cost: 3,03; Package: штырьевой; ComponentLink1Description: Datasheet; ComponentLink2Description: Datasheet-local
C8-C10 C12-C23 = Capacitor 0805 100n: Generic capasitor non-polar; PartNumber: Capacitor 0805 100n; Value: 100n; ComponentLink1Description: Datasheet; Package: 0805
C11 = 470000_050: 470uF 50V Polar capacitor; Manufacturer: Yageo; ManufacturerPartNumber: CA035M0220REG; Supplier: Промэлектроника; Cost: 20,14; Package: not standard; ComponentLink1Description: Datasheet; ComponentLink1URL: http://www.promelec.ru/pdf/CA_2011.pdf; ComponentLink2Description: Datasheet-local; ComponentLink2URL: *
DD1-DD3 = Atmega324P-20AU: as DD1 on sheet Water_SCH; ComponentLink1URL: http://www.atmel.com/Images/Atmel-8011-8-bit-AVR-Microcontroller-ATmega164P-324P-644P_datasheet.pdf; ComponentLink1Description: Datasheet; Cost: 220; Package: TQFP-44; Supplier: Промэлектроника; ManufacturerPartNumber: Atmega324P-20AU
FU1 = EFuse LP60-110F: Fuse; ManufacturerPartNumber: EFuse LP60-110F; ComponentLink1Description: Datasheet; ComponentLink2Description: Datasheet-local; ComponentLink2URL: *
HL12 HL13 = LED1_G: Diod LED SMD Green; ComponentLink1Description: Datasheet; Cost: 2,88; ComponentLink2Description: Datasheet-local; ComponentLink2URL: *; Color: Green
L2 = SCD0705T-331K-N: Inductor; ManufacturerPartNumber: SCD0705T-331K-N; ComponentLink1Description: Datasheet; ComponentLink1URL: http://download.siliconexpert.com/pdfs/2010/12/8/6/47/4/732/yageo_/manual/inductors_smdpower_scd_2010.pdf; ComponentLink2Description: Datasheet-local; ComponentLink2URL: *
L3-L14 = Ferrite Bead: Value: ? мГн; ManufacturerPartNumber: MPZ1608S181A; ComponentLink1Description: Datasheet; Supplier: Промэлектроника; ComponentLink2Description: Datasheet-local; ComponentLink2URL: *
R44 R45 = Resistor 0805 750: Generic resistor; PartNumber: Resistor 0805 750; Value: 750; ComponentLink1URL: http://www.mouser.com/ds/2/447/PYu-RC0402_51_RoHS_L_6_r-8721.pdf; ComponentLink1Description: Datasheet; Package: 0805
VD10 = SM15T12CA: Diod suppressor; Manufacturer: ST Microelectronics; Notes: 12 В; ComponentLink1Description: Datasheet; ComponentLink1URL: http://www.st.com/st-web-ui/static/active/en/resource/technical/document/datasheet/CD00000724.pdf; Cost: 16,73; Package: SMC/DO-214AB; Supplier: Промэлектроника; ComponentLink2Description: Datasheet-local; ComponentLink2URL: *; ManufacturerPartNumber: SM15T12CA
VD11 = 10BQ060TRPBF: DIODE SCHOTTKY 60V 1A DO214AA; Manufacturer: Vishay Semiconductor Diodes Division; Voltage - Forward (Vf) (Max) @ If: 600mV @ 1A; Current - Reverse Leakage @ Vr: 100µA @ 60V; Category: Discrete Semiconductor Products; Diode Type: Schottky; Voltage - DC Reverse (Vr) (Max): 60V; Current - Average Rectified (Io): 1A; Reverse Recovery Time (trr): -; Mounting Type: Surface Mount; Package / Case: DO-214AA, SMB; Operating Temperature - Junction: -55°C ~ 150°C; ComponentLink1URL: http://www.vishay.com/docs/94113/vs-10bq060pbf.pdf; ComponentLink1Description: http://www.vishay.com/docs/94113/vs-10bq060pbf.pdf; ManufacturerPartNumber: 10BQ060TRPBF
VD12-VD15 = 1N4001: Rectifying diode; ComponentLink1Description: Datasheet; ComponentLink1URL: http://www.promelec.ru/pdf/1N400x.pdf; Cost: 5; Package: штырьевой; ComponentLink2Description: Datasheet-local; ComponentLink2URL: *; ManufacturerPartNumber: 1N4001
DA1 = LM2574M-5.0: ManufacturerPartNumber: LM2574M-5.0

## Nets that join several sheets
+5V: TopSCH (6 pins), Water_SCH (15 pins), heatersControl (12 pins), Spin_SCH (24 pins), Master_SCH (11 pins), Power_SCH (16 pins)
+12V: TopSCH (XT15.1), Water_SCH (K1.5 K2.5), Spin_SCH (K10.5 K11.5)
AGND: Water_SCH (XT4.2 XT6.2), Master_SCH (8 pins), Power_SCH (9 pins)
GND: TopSCH (6 pins), Water_SCH (23 pins), heatersControl (12 pins), Spin_SCH (34 pins), Master_SCH (11 pins), Power_SCH (30 pins)
heater1: Water_SCH (DD1.44), heatersControl (R25.1)
heater2: Water_SCH (DD1.43), heatersControl (R26.1)
heater3: Water_SCH (DD1.42), heatersControl (R27.1)
NetDD1_19: TopSCH (R46.1 R48.2 XS2.5), Water_SCH (DD1.19), Spin_SCH (DD2.19), Master_SCH (DD3.19)
NetDD1_20: TopSCH (R47.1 R49.2 XS2.6), Water_SCH (DD1.20), Spin_SCH (DD2.20), Master_SCH (DD3.20)
NetDD3_12: TopSCH (XS2.7), Master_SCH (DD3.12)
NetDD3_13: TopSCH (XS2.3), Master_SCH (DD3.13)
NetDD3_14: TopSCH (XS2.4), Master_SCH (DD3.14)
~12V_PHASE: TopSCH (XS2.1 XT14.1), Power_SCH (VD12.A VD14.K)
~12V_ZERO: TopSCH (XS2.2 XT14.2), Power_SCH (VD13.A VD15.K)